# EasyEDA Pro project ProPrj_ax_driver_2025-11-09.epro, board axdr_v1.2
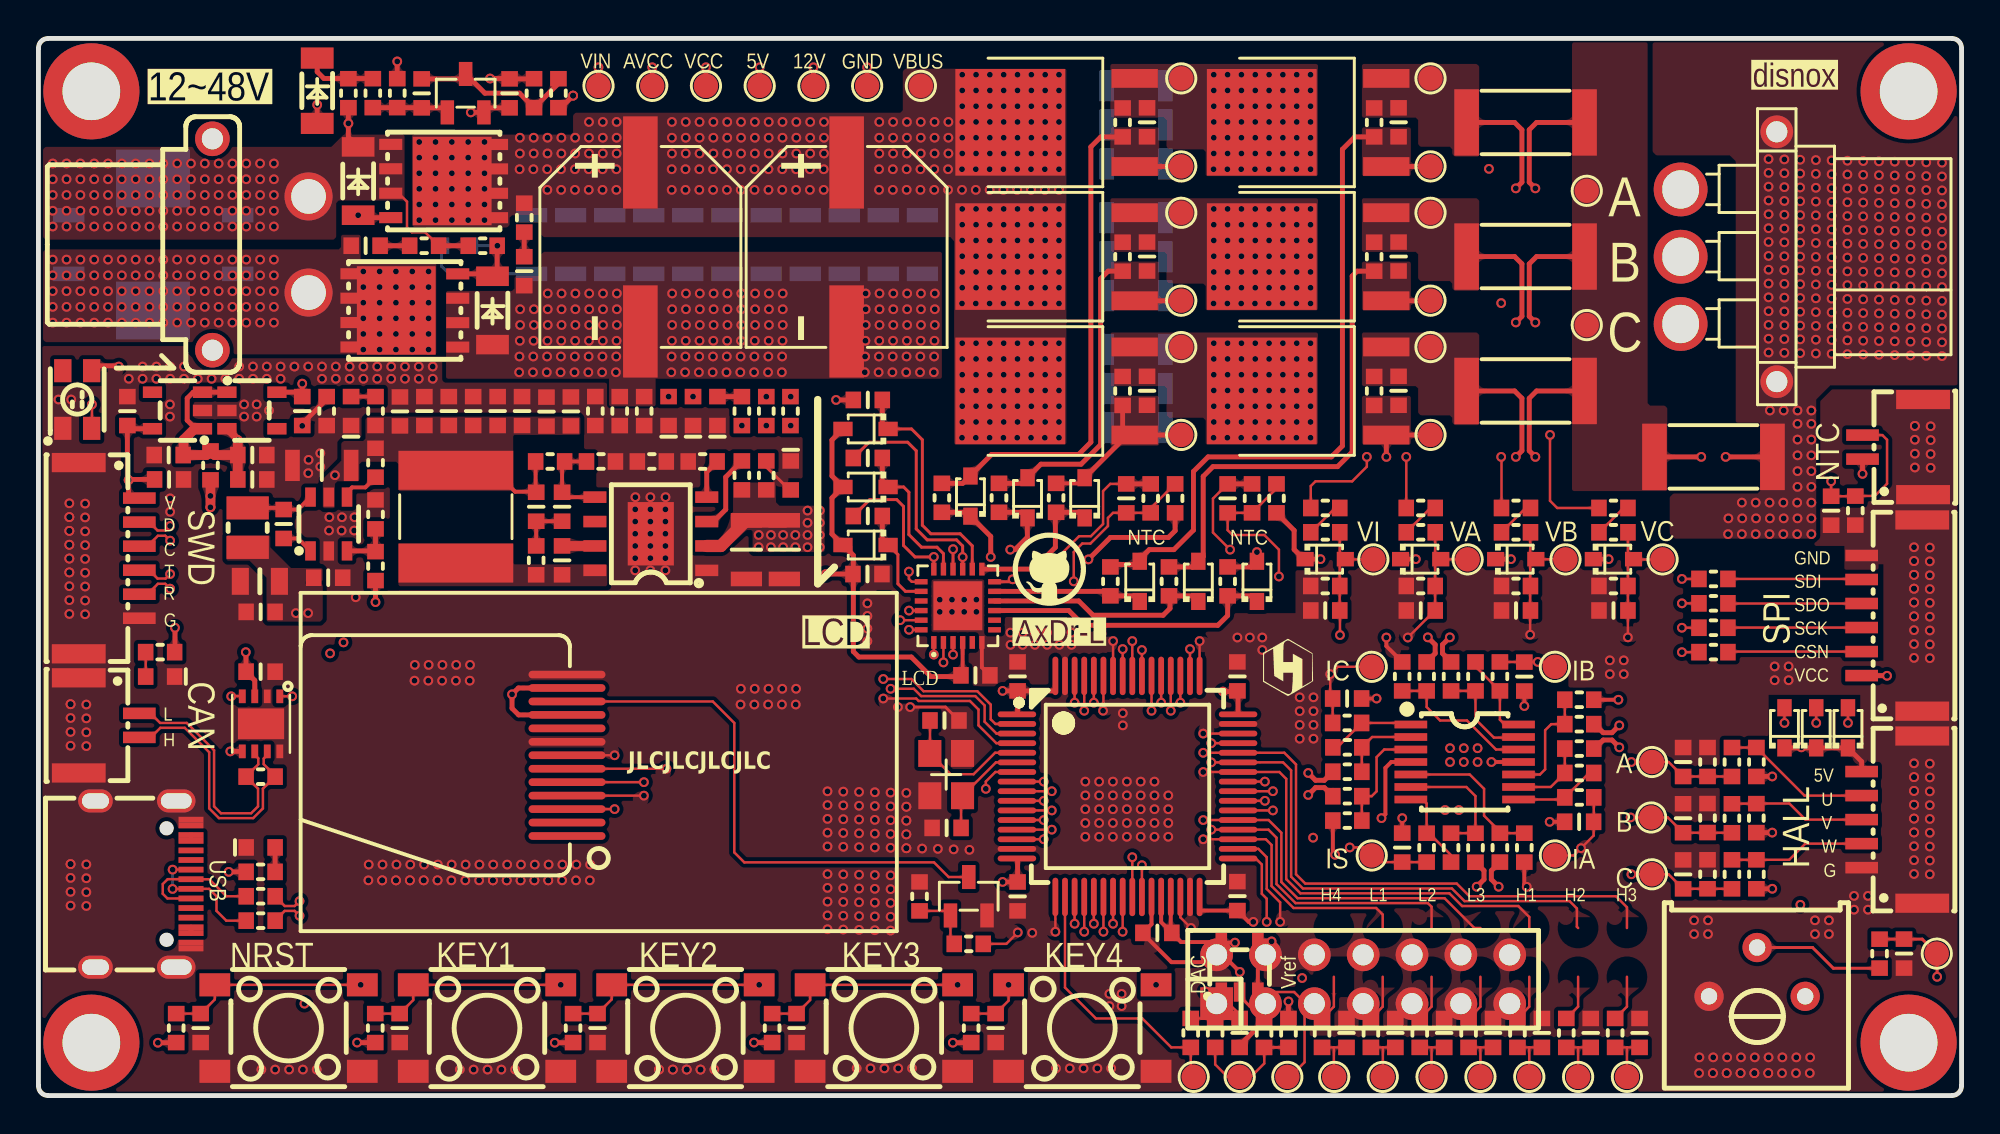
[diagram p10: board, top side]
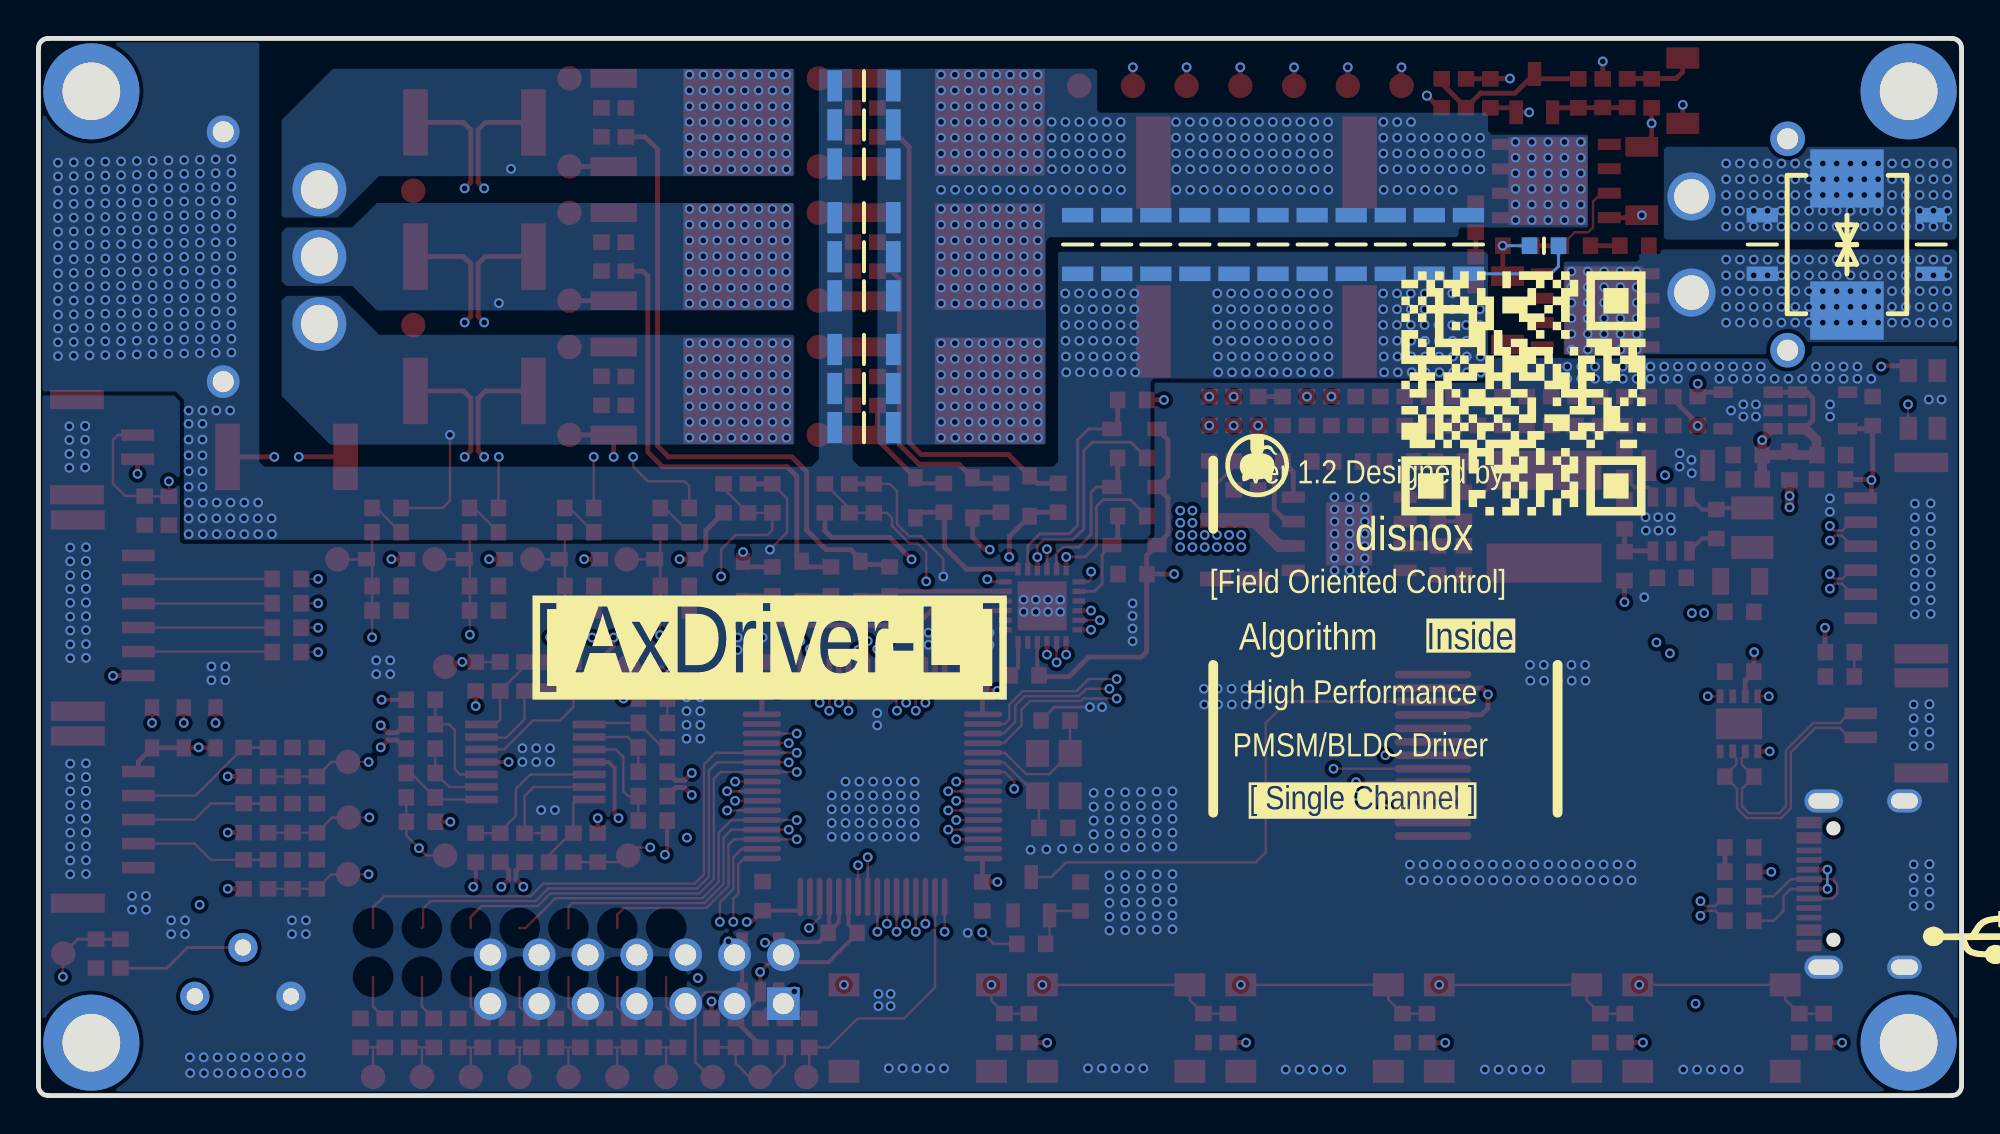
[diagram p11: board, bottom side, seen from below]

Outline 100 x 55 mm; copper layers: Top Layer, Inner1, Inner2, 内层3, 内层4, Bottom Layer. Coordinates in mm from the lower left corner of the outline.
Outline path: 0,54.5 arc(0.15,54.85) 0.5,55 99.5,55 arc(99.85,54.85) 100,54.5 100,0.5 arc(99.85,0.15) 99.5,0 0.5,0 arc(0.15,0.15) 0,0.5 0,54.5
Stack: Top Layer 0.035mm 外层铜厚1oz / Dielectric1 0.0994mm 3313 RC57% 4.2mil / Inner1 0.0152mm 内层铜厚 / Dielectric2 0.55mm 0.55mm H/H不含铜 / Inner2 0.0152mm 内层铜厚 / Dielectric3 0.1088mm 2116 RC54% 4.9mil / 内层3 0.0152mm 内层铜厚 / Dielectric4 0.55mm 0.55mm H/H不含铜 / 内层4 0.0152mm 内层铜厚 / Dielectric5 0.0994mm 3313 RC57% 4.2mil / Bottom Layer 0.035mm 外层铜厚1oz

## Design rules (mm)
template: 用户自定义配置
spacing safeClearance (default): track to track 0.127, other pairs 0.127 to 0.127
track width trackWidth (default): min 0.127, default 0.254, max 2.54
differential pair differentialPair (default): width min 0.127, default 0.254, max 2.54; gap min 0.127, default 0.127
via viaSize (default): diameter min 0.5, default 0.508, max 10; hole min 0.3, default 0.305, max 5.999

## Placement (name value [footprint] x y rotation side)
C1  100nF  [C0603_S]  24.5 52.15 90 top
C2  100nF  [C0603_S]  19.93 52.15 90 top
C3  220uF  [CAP-SMD_BD10.0-L10.3-W10.3-LS11.0-R-RD]  42.02 44.15 90 top
C4  220uF  [CAP-SMD_BD10.0-L10.3-W10.3-LS11.0-R-RD]  31.3 44.15 90 top
C5  10uF  [C1206_S]  37.83 44.41 270 bottom
C6  10uF  [C1206_S]  39.87 44.41 270 bottom
C7  10uF  [C1206_S]  45.96 44.41 270 bottom
C8  10uF  [C1206_S]  35.8 44.41 270 bottom
C9  10uF  [C1206_S]  33.77 44.41 270 bottom
C10  10uF  [C1206_S]  31.74 44.41 270 bottom
C11  10uF  [C1206_S]  43.93 44.41 270 bottom
C12  10uF  [C1206_S]  41.9 44.41 270 bottom
C13  10uF  [C1206_S]  27.67 44.41 270 bottom
C14  10uF  [C1206_S]  25.64 44.41 270 bottom
C15  10uF  [C1206_S]  29.71 44.41 270 bottom
C16  10uF  [C1206_S]  1.57 44.41 270 bottom
C17  10uF  [C1206_S]  10.36 44.41 270 bottom
C18  10nF  [C0603_S]  17.01 44.22 180 top
C19  100nF  [C0603_S]  21.7 44.22 180 bottom
C20  10nF  [C0603_S]  25.26 42.88 270 top
C21  2.2nF  [C0603_S]  27.23 27.84 270 top
C22  3.3nF  [C0603_S]  25.88 30.63 270 top
C23  10uF  [C1206_S]  38.79 28.53 270 top
C24  100nF  [C1206_S]  36.81 28.28 90 top
C25  2.2nF  [C0603_S]  27.23 30.63 270 top
C26  100nF  [C0603_S]  43.12 27.13 0 top
C27  10uF  [C0603_S]  26.42 35.58 270 top
C28  10uF  [C0603_S]  21.34 35.6 270 top
C29  10uF  [C1206_S]  14.86 32.78 180 top
C30  100nF  [C0603_S]  11.11 33.33 180 top
C31  100nF  [C0603_S]  62.34 21.8 270 top
C32  100nF  [C0603_S]  50.91 10.37 90 top
C33  100nF  [C0603_S]  6.78 32.05 180 top
C34  22pF  [C0603_S]  47.1 19.51 180 top
C35  22pF  [C0603_S]  47.23 13.93 0 top
C36  100nF  [C0603_S]  11.11 32.05 180 top
C37  10uF  [C0603_S]  18.8 35.6 90 top
C38  10uF  [C0603_S]  20.07 35.6 270 top
C39  10uF  [C0603_S]  27.69 35.6 90 top
C40  100nF  [C0603_S_3]  12.75 29.75 90 top
C41  100nF  [C0603_S]  6.78 33.33 0 top
C42  100nF  [C0603_S]  13.72 35.62 90 top
C43  100nF  [C0603_S]  58.19 8.46 0 top
C44  10uF  [C0805_S]  11.51 26.75 0 top
C45  100nF  [C0603_S]  11.56 25.16 0 top
C46  100nF  [C0603_S]  15.06 26.94 180 top
C47  100nF  [C0603_S]  11.54 22.05 180 top
C48  100nF  [C0603_S]  8.43 3.52 90 top
C49  100nF  [C0603_S]  18.78 3.52 90 top
C50  100nF  [C0603_S]  29.07 3.52 90 top
C51  100nF  [C0603_S]  39.42 3.52 90 top
C52  100nF  [C0603_S]  49.77 3.52 90 top
C53  1nF  [C0603_S]  97.01 7.39 90 top
C54  10nF  [C0603_S]  62.46 3.27 90 top
C55  100nF  [C0603_S]  50.91 21.8 270 top
C56  100nF  [C0603_S]  62.34 10.37 270 top
C57  100nF  [C0603_S]  4.62 35.6 270 top
C58  10uF  [C0603_S]  23.88 35.6 270 top
C59  10uF  [C0603_S]  25.15 35.6 270 top
C60  10uF  [C0603_S]  22.61 35.6 270 top
C61  1nF  [C0603_S]  70.91 12.89 270 top
C62  1nF  [C0603_S]  68.04 20.66 180 top
C63  1nF  [C0603_S]  57.65 50.63 270 top
C64  1nF  [C0603_S]  57.65 43.64 270 top
C65  1nF  [C0603_S]  57.65 36.66 270 top
C66  1uF  [C0603_S]  43.13 30.15 0 top
C67  1nF  [C0603_S]  80.12 14.24 0 top
C68  1nF  [C0603_S]  77.26 21.81 90 top
C69  100nF  [C0603_S]  48.71 21.86 180 top
C70  1uF  [C0603_S]  43.13 33.17 0 top
C71  1uF  [C0603_S]  43.13 36.19 0 top
C72  1nF  [C0603_S]  70.73 50.63 270 top
C73  1nF  [C0603_S]  70.73 43.64 270 top
C74  1nF  [C0603_S]  70.73 36.66 270 top
C75  1nF  [C0603_S]  71.89 25.24 0 top
C76  1nF  [C0603_S]  76.84 25.24 0 top
C77  1nF  [C0603_S]  81.91 25.24 0 top
C78  1nF  [C0603_S]  66.92 25.24 0 top
C79  1nF  [C0603_S]  61.84 31.06 270 top
C80  1nF  [C0603_S]  56.57 31.06 270 top
C81  1nF  [C0603_S]  93.22 30.44 90 top
C82  100nF  [C0603_S]  85.52 17.36 90 top
C83  100nF  [C0603_S]  85.52 14.44 90 top
C84  100nF  [C0603_S]  85.52 11.52 90 top
C85  100nF  [C0603_S]  78.18 3.27 90 top
C86  100nF  [C0603_S]  80.72 3.27 90 top
C87  100nF  [C0603_S]  83.26 3.27 90 top
C88  100nF  [C0603_S]  68.02 3.27 90 top
C91  100nF  [C0603_S]  70.56 3.27 90 top
C92  100nF  [C0603_S]  73.1 3.27 90 top
C93  100nF  [C0603_S]  75.64 3.27 90 top
C96  10uF  [C1206_S]  56.95 52.53 0 bottom
C97  10uF  [C1206_S]  56.95 45.68 0 bottom
C98  10uF  [C1206_S]  56.95 36.79 0 bottom
C99  10uF  [C1206_S]  56.95 50.5 0 bottom
C100  10uF  [C1206_S]  56.95 43.64 0 bottom
C101  10uF  [C1206_S]  56.95 48.47 0 bottom
C102  10uF  [C1206_S]  56.95 38.82 0 bottom
C103  10uF  [C1206_S]  56.95 41.61 0 bottom
C104  10uF  [C1206_S]  56.95 34.75 0 bottom
CN1  5012  [TESTPOINT-TH_BD2.0_C9900010656]  29.12 52.53 180 top
CN2  5012  [TESTPOINT-TH_BD2.0_C9900010656]  45.88 52.53 180 top
CN3  XT30PW-F  [CONN-TH_XT30PW-F]  11.54 44.28 270 top
CN4  5012  [TESTPOINT-TH_BD2.0_C9900010656]  40.3 52.53 0 top
CN5  5012  [TESTPOINT-TH_BD2.0_C9900010656]  34.71 52.53 180 top
CN6  5012  [TESTPOINT-TH_BD2.0_C9900010656]  43.09 52.53 0 top
CN7  5012  [TESTPOINT-TH_BD2.0_C9900010656]  37.5 52.53 0 top
CN8  5012  [TESTPOINT-TH_BD2.0_C9900010656]  31.91 52.53 270 top
CN9  WAFER-GH1.25-6PWB  [CONN-SMD_6P-P1.25_XUNPU_WAFER-GH1.25-6PWB]  3.67 27.96 270 top
CN10  5012  [TESTPOINT-TH_BD2.0_C9900010656]  98.71 7.38 0 top
CN11  X1251WRS-02HF-LPSW  [CONN-SMD_2P-P1.25_X1251WRS-02HF-LPSW]  3.54 19.26 270 top
CN12  5012  [TESTPOINT-TH_BD2.0_C9900010656]  60.07 0.97 0 top
CN13  5012  [TESTPOINT-TH_BD2.0_C9900010656]  64.94 0.97 0 top
CN14  5012  [TESTPOINT-TH_BD2.0_C9900010656]  69.33 12.49 0 top
CN15  5012  [TESTPOINT-TH_BD2.0_C9900010656]  69.33 22.31 0 top
CN16  5012  [TESTPOINT-TH_BD2.0_C9900010656]  62.46 0.97 0 top
CN17  5012  [TESTPOINT-TH_BD2.0_C9900010656]  59.42 48.34 0 top
CN18  5012  [TESTPOINT-TH_BD2.0_C9900010656]  59.42 41.36 0 top
CN19  5012  [TESTPOINT-TH_BD2.0_C9900010656]  59.42 34.37 0 top
CN20  5012  [TESTPOINT-TH_BD2.0_C9900010656]  78.85 12.49 180 top
CN21  5012  [TESTPOINT-TH_BD2.0_C9900010656]  78.85 22.31 0 top
CN22  5012  [TESTPOINT-TH_BD2.0_C9900010656]  59.42 52.92 0 top
CN23  5012  [TESTPOINT-TH_BD2.0_C9900010656]  59.42 45.93 0 top
CN24  5012  [TESTPOINT-TH_BD2.0_C9900010656]  59.42 38.94 0 top
CN25  5012  [TESTPOINT-TH_BD2.0_C9900010656]  72.39 48.34 0 top
CN26  5012  [TESTPOINT-TH_BD2.0_C9900010656]  72.39 41.36 0 top
CN27  5012  [TESTPOINT-TH_BD2.0_C9900010656]  72.39 34.37 0 top
CN28  5012  [TESTPOINT-TH_BD2.0_C9900010656]  72.39 52.92 0 top
CN29  5012  [TESTPOINT-TH_BD2.0_C9900010656]  72.39 45.93 0 top
CN30  5012  [TESTPOINT-TH_BD2.0_C9900010656]  72.39 38.94 0 top
CN31  5012  [TESTPOINT-TH_BD2.0_C9900010656]  83.9 17.35 270 top
CN32  5012  [TESTPOINT-TH_BD2.0_C9900010656]  83.86 14.47 270 top
CN33  5012  [TESTPOINT-TH_BD2.0_C9900010656]  83.9 11.51 270 top
CN34  X1251WRS-02HF-LPSW  [CONN-SMD_2P-P1.25_X1251WRS-02HF-LPSW]  96.55 33.74 90 top
CN35  5012  [TESTPOINT-TH_BD2.0_C9900010656]  80.51 40.09 0 top
CN36  5012  [TESTPOINT-TH_BD2.0_C9900010656]  80.51 47.07 0 top
CN37  5012  [TESTPOINT-TH_BD2.0_C9900010656]  74.32 27.9 90 top
CN38  5012  [TESTPOINT-TH_BD2.0_C9900010656]  79.4 27.9 90 top
CN39  5012  [TESTPOINT-TH_BD2.0_C9900010656]  84.45 27.9 90 top
CN40  5012  [TESTPOINT-TH_BD2.0_C9900010656]  69.41 27.9 90 top
CN41  MR30PW-F  [CONN-TH_MR30PW-F]  87.89 43.64 90 top
CN42  5012  [TESTPOINT-TH_BD2.0_C9900010656]  77.52 0.97 90 top
CN43  5012  [TESTPOINT-TH_BD2.0_C9900010656]  80.06 0.97 0 top
CN44  5012  [TESTPOINT-TH_BD2.0_C9900010656]  82.6 0.97 0 top
CN45  5012  [TESTPOINT-TH_BD2.0_C9900010656]  67.38 0.97 0 top
CN47  WAFER-GH1.25-6PWB  [CONN-SMD_6P-P1.25_XUNPU_WAFER-GH1.25-6PWB]  96.38 24.97 90 top
CN49  5012  [TESTPOINT-TH_BD2.0_C9900010656]  69.9 0.97 0 top
CN50  5012  [TESTPOINT-TH_BD2.0_C9900010656]  72.44 0.97 180 top
CN51  5012  [TESTPOINT-TH_BD2.0_C9900010656]  74.98 0.97 0 top
D1  ZMM12V  [LL-34_L3.5-W1.5-RD-2]  16.62 47.58 270 top
D2  1.5SMC30CAHE3/57T  [SMC_L6.8-W5.9-LS7.8-BI]  5.96 44.28 270 bottom
D3  ZMM12V  [LL-34_L3.5-W1.5-RD-2]  23.61 40.85 270 top
D4  TCLLZ39VTR  [LL-34_L3.5-W1.5-RD]  14.49 52.28 270 top
D5  B16WS  [SOD-323_L1.8-W1.3-LS2.5-RD#2]  48.46 31.19 90 top
D6  B16WS  [SOD-323_L1.8-W1.3-LS2.5-RD#2]  51.43 31.1 90 top
D7  B16WS  [SOD-323_L1.8-W1.3-LS2.5-RD#2]  54.4 31.1 90 top
D8  B16WS  [SOD-323_L1.8-W1.3-LS2.5-RD]  43.01 28.64 180 top
D9  B16WS  [SOD-323_L1.8-W1.3-LS2.5-RD]  43.01 31.66 180 top
D10  B16WS  [SOD-323_L1.8-W1.3-LS2.5-RD]  43.01 34.68 180 top
D11  B16WS  [SOD-323_L1.8-W1.3-LS2.5-RD#2]  57.26 26.75 90 top
D12  B16WS  [SOD-323_L1.8-W1.3-LS2.5-RD#2]  60.31 26.75 90 top
D13  B16WS  [SOD-323_L1.8-W1.3-LS2.5-RD#2]  63.36 26.75 90 top
D14  B16WS  [SOD-323_L1.8-W1.3-LS2.5-RD#2]  94.09 19.13 90 top
D15  B16WS  [SOD-323_L1.8-W1.3-LS2.5-RD#2]  71.87 27.91 0 top
D16  B16WS  [SOD-323_L1.8-W1.3-LS2.5-RD#2]  76.82 27.91 0 top
D17  B16WS  [SOD-323_L1.8-W1.3-LS2.5-RD#2]  81.9 27.91 0 top
D18  B16WS  [SOD-323_L1.8-W1.3-LS2.5-RD#2]  66.91 27.91 0 top
D19  B16WS  [SOD-323_L1.8-W1.3-LS2.5-RD#2]  90.79 19.13 90 top
D20  B16WS  [SOD-323_L1.8-W1.3-LS2.5-RD#2]  92.44 19.13 90 top
H1  2.54-2*7P针  [HDR-TH_14P-P2.54-V-F-R2-C6-S2.54]  67.36 6.18 0 top
IPSLCD1  TFT_1.14_135x240_13pin  [焊接式_TFT_1.14_135X240_13PIN]  13.63 17.35 180 top
K1  TS-KG02S  [SW-SMD_4P-L6.0-W6.0-P4.50-LS8.5]  13 3.51 0 top
K2  TS-KG02S  [SW-SMD_4P-L6.0-W6.0-P4.50-LS8.5]  23.32 3.51 0 top
K3  TS-KG02S  [SW-SMD_4P-L6.0-W6.0-P4.50-LS8.5]  33.64 3.51 0 top
K4  TS-KG02S  [SW-SMD_4P-L6.0-W6.0-P4.50-LS8.5]  43.96 3.51 0 top
K5  TS-KG02S  [SW-SMD_4P-L6.0-W6.0-P4.50-LS8.5]  54.28 3.51 0 top
L1  NCD0603R1  [LED0603_S]  39.12 32.89 90 top
L2  68uH  [IND-SMD_L6.0-W6.0_SMNR6045]  21.7 30.12 270 top
L3  NCD0603R1  [LED0603_S]  6.96 21.8 0 top
L4  NCD0603R1  [LED0603_S]  16.26 34.99 270 top
L5  NCD0603R1  [LED0603_S]  10.93 12.91 180 top
L6  NCD0603G1  [LED0603_S]  32.77 34.99 270 top
L7  4.7uH  [IND-SMD_L2.5-W2.0]  10.88 29.55 90 top
L8  NCD0603W1  [LED0603_S]  34.04 34.99 270 top
L9  NCD0603B1  [LED0603_S]  35.31 34.99 270 top
LED1  XL-3528RGBW-WS2812B  [LED-SMD_4P-L3.5-W2.8-BR-1]  2.02 36.21 270 top
NOREF  -  [Pad_e113]  2.75 52.25 0 top
NOREF#2  -  [Pad_e122]  97.25 2.75 0 top
NOREF#3  -  [Pad_e124]  97.25 52.25 0 top
NOREF#4  -  [Pad_e118]  2.75 2.75 0 top
NTC1  NCP18XH103F03RB  [R0603_S]  63.11 31.07 90 top
NTC2  NCP18XH103F03RB  [R0603_S]  57.84 31.07 90 top
Q1  WSD90P06DN56  [DFN-8_L5.8-W4.9-P1.27-LS6.0-BL-1]  21.07 47.58 270 top
Q2  FMMT593  [SOT-23-3_L2.9-W1.3-P1.90-LS2.4-BR]  22.21 52.15 270 top
Q3  WSD80120DN56  [DFN-8_L5.8-W4.9-P1.27-LS6.0-BL-1]  19.05 40.85 90 top
Q4  SS8050  [SOT-23-3_L2.9-W1.3-P1.90-LS2.4-BR]  48.37 10.37 270 top
Q5  NCE7560K  [TO-252-2_L6.6-W6.1-P4.58-LS9.9-BR]  53.96 50.63 0 top
Q6  NCE7560K  [TO-252-2_L6.6-W6.1-P4.58-LS9.9-BR]  53.96 43.64 0 top
Q7  NCE7560K  [TO-252-2_L6.6-W6.1-P4.58-LS9.9-BR]  53.96 36.66 0 top
Q8  NCE7560K  [TO-252-2_L6.6-W6.1-P4.58-LS9.9-BR]  67.04 50.63 0 top
Q9  NCE7560K  [TO-252-2_L6.6-W6.1-P4.58-LS9.9-BR]  67.04 43.64 0 top
Q10  NCE7560K  [TO-252-2_L6.6-W6.1-P4.58-LS9.9-BR]  67.04 36.66 0 top
R1  10kΩ  [R0603_S]  37.85 32.26 270 top
R2  1.5MΩ  [R0603_S]  18.66 52.15 90 top
R3  100kΩ  [R0603_S]  16.12 52.15 270 top
R4  22Ω  [R0603_S]  20.05 44.22 0 top
R5  100kΩ  [R0603_S]  23.1 44.22 180 top
R6  1kΩ  [R0603_S]  17.39 52.15 90 top
R7  22Ω  [R0603_S]  25.26 45.68 90 top
R8  1kΩ  [R0603_S]  25.77 52.15 270 top
R9  1kΩ  [R0603_S]  27.04 52.15 270 top
R10  0Ω  [R0603_S]  31.5 35.61 270 top
R11  0Ω  [R0603_S]  30.23 35.61 270 top
R12  0Ω  [R0603_S]  14.99 35.61 270 top
R13  453kΩ  [R0603_S]  25.88 27.84 90 top
R14  1kΩ  [R0603_S]  6.33 23.07 180 top
R15  100kΩ  [R0603_S]  36.58 32.26 90 top
R16  453kΩ  [R0603_S]  26.6 32.99 0 top
R17  22Ω  [R0603_S]  11.55 9.1 0 top
R18  22Ω  [R0603_S]  11.55 10.37 0 top
R19  100kΩ  [R0603_S]  34.54 32.99 180 top
R20  49.9kΩ  [R0603_S]  29.25 32.99 0 top
R21  1kΩ  [R0603_S]  48.37 7.89 0 top
R22  1kΩ  [R0603_S]  45.82 10.36 90 top
R23  0Ω  [R0603_S]  31.89 32.99 0 top
R24  0Ω  [R0603_S]  28.96 35.61 90 top
R25  10kΩ  [R0603_S]  17.53 35.61 270 top
R26  1kΩ  [R0603_S]  11.55 11.64 180 top
R27  0Ω  [R0603_S]  8.95 32.78 90 top
R28  1kΩ  [R0603_S]  39.1 35.61 270 top
R29  10kΩ  [R0603_S]  7.16 3.51 270 top
R30  10kΩ  [R0603_S]  17.51 3.51 270 top
R31  10kΩ  [R0603_S]  27.8 3.51 270 top
R32  10kΩ  [R0603_S]  38.15 3.51 270 top
R33  10kΩ  [R0603_S]  48.5 3.51 270 top
R34  1kΩ  [R0603_S]  37.85 35.61 90 top
R35  10kΩ  [RES-ADJ-TH_3P-L9.5-W9.5-P2.50-L_3386P]  89.37 6.43 180 top
R36  62kΩ  [R0603_S]  17.53 27.55 90 top
R37  10kΩ  [R0603_S]  95.74 7.38 270 top
R38  10kΩ  [R0603_S]  17.53 32.92 90 top
R39  12kΩ  [R0603_S]  17.53 30.23 90 top
R40  1kΩ  [R0603_S]  36.58 35.61 270 top
R41  20kΩ  [R0603_S]  73.45 12.9 90 top
R42  20kΩ  [R0603_S]  68.06 18.12 0 top
R44  1kΩ  [R0603_S]  74.72 12.89 90 top
R45  1kΩ  [R0603_S]  68.06 16.85 0 top
R46  10kΩ  [R0603_S]  65 3.26 90 top
R47  0Ω  [R0603_S]  59.92 3.26 90 top
R49  1kΩ  [R0603_S]  75.99 12.9 90 top
R50  22Ω  [R0603_S]  72.18 12.9 90 top
R51  20kΩ  [R0603_S]  77.26 12.9 90 top
R52  1kΩ  [R0603_S]  68.06 15.58 0 top
R53  22Ω  [R0603_S]  68.05 19.39 0 top
R54  0Ω  [R0603_S]  61.19 3.26 90 top
R55  20kΩ  [R0603_S]  68.06 14.31 0 top
R57  10kΩ  [R0603_S]  63.73 3.26 270 top
R59  22Ω  [R0603_S]  46.98 31.1 270 top
R60  22Ω  [R0603_S]  49.95 31.1 270 top
R61  22Ω  [R0603_S]  52.92 31.1 270 top
R62  10kΩ  [R0603_S]  56.38 50.63 90 top
R63  10kΩ  [R0603_S]  56.38 43.64 90 top
R64  10kΩ  [R0603_S]  56.38 36.66 90 top
R65  20kΩ  [R0603_S]  80.12 16.78 180 top
R66  20kΩ  [R0603_S]  74.72 21.81 270 top
R67  1kΩ  [R0603_S]  80.12 18.05 180 top
R68  1kΩ  [R0603_S]  73.45 21.81 270 top
R69  1kΩ  [R0603_S]  80.12 19.32 180 top
R70  22Ω  [R0603_S]  80.12 15.51 180 top
R71  20kΩ  [R0603_S]  80.12 20.59 180 top
R72  1kΩ  [R0603_S]  72.19 21.81 270 top
R73  22Ω  [R0603_S]  76 21.81 270 top
R74  20kΩ  [R0603_S]  70.91 21.81 270 top
R75  22Ω  [R0603_S]  55.74 26.75 270 top
R76  22Ω  [R0603_S]  58.79 26.75 270 top
R77  22Ω  [R0603_S]  61.84 26.75 270 top
R78  10kΩ  [R0603_S]  69.46 50.63 90 top
R79  10kΩ  [R0603_S]  69.46 43.64 90 top
R80  10kΩ  [R0603_S]  69.46 36.66 90 top
R81  5mΩ  [R2512_S]  77.33 50.63 0 top
R82  5mΩ  [R2512_S]  77.33 43.65 0 top
R83  5mΩ  [R2512_S]  77.33 36.66 0 top
R84  15kΩ  [R0603_S]  71.88 30.57 0 top
R85  15kΩ  [R0603_S]  76.83 30.57 0 top
R86  15kΩ  [R0603_S]  81.9 30.57 0 top
R87  15kΩ  [R0603_S]  66.91 30.57 0 top
R88  10kΩ  [R0603_S]  89.33 17.35 90 top
R89  10kΩ  [R0603_S]  89.33 14.43 90 top
R90  10kΩ  [R0603_S]  89.33 11.51 90 top
R91  15kΩ  [R0603_S]  71.88 29.31 0 top
R92  15kΩ  [R0603_S]  76.83 29.31 0 top
R93  15kΩ  [R0603_S]  81.9 29.31 0 top
R94  15kΩ  [R0603_S]  66.91 29.31 0 top
R95  10kΩ  [R0603_S]  88.06 17.35 270 top
R96  120Ω  [R0603_S]  11.55 16.59 180 top
R97  10kΩ  [R0603_S]  88.06 14.43 270 top
R98  10kΩ  [R0603_S]  88.06 11.51 270 top
R99  2kΩ  [R0603_S]  71.88 26.51 180 top
R100  2kΩ  [R0603_S]  76.83 26.51 180 top
R101  2kΩ  [R0603_S]  81.9 26.51 180 top
R102  2kΩ  [R0603_S]  66.91 26.51 180 top
R103  10kΩ  [R0603_S]  64.38 31.07 90 top
R104  10kΩ  [R0603_S]  59.11 31.07 90 top
R105  10kΩ  [R0603_S]  94.48 30.44 270 top
R106  10kΩ  [R0603_S]  86.79 17.35 90 top
R107  10kΩ  [R0603_S]  86.79 14.44 90 top
R108  10kΩ  [R0603_S]  86.79 11.51 90 top
R109  5mΩ  [R2512_S]  87.1 33.23 0 top
R111  10kΩ  [R0603_S]  76.91 3.26 90 top
R112  10kΩ  [R0603_S]  79.45 3.26 90 top
R113  10kΩ  [R0603_S]  81.99 3.26 90 top
R114  10kΩ  [R0603_S]  66.75 3.26 90 top
R117  22Ω  [R0603_S]  87.1 26.88 180 top
R118  22Ω  [R0603_S]  87.1 25.61 180 top
R120  22Ω  [R0603_S]  87.1 24.34 180 top
R121  22Ω  [R0603_S]  87.1 23.07 180 top
R122  10kΩ  [R0603_S]  69.29 3.26 90 top
R123  10kΩ  [R0603_S]  71.83 3.26 90 top
R124  10kΩ  [R0603_S]  74.37 3.26 90 top
U1  STM32G431RBT6  [LQFP-64_L10.0-W10.0-P0.50-LS12.0-BL]  56.63 16.08 270 top
U2  LM5164DDAR  [ESOP-8_L4.9-W3.9-P1.27-LS6.0-BL-EP]  31.84 29.23 90 top
U3  XC6210B332MR  [SOT-23-5_L3.0-W1.7-P0.95-LS2.8-BR]  7.23 35.64 0 top
U4  LP5907QMFX-3.3Q1  [SOT-23-5_L3.0-W1.7-P0.95-LS2.8-BR]  11.1 35.64 180 top
U5  RY8411  [SOT-23-6_L2.9-W1.6-P0.95-LS2.8-BR]  15.1 29.74 270 top
U6  LM321MF/NOPB  [SOT-23-5_L3.0-W1.7-P0.95-LS2.8-BR]  62.46 6.69 270 top
U7  FD6288Q  [QFN-24_L4.0-W4.0-P0.50-BL-EP2.6]  47.81 25.48 0 top
U8  WAFER-GH1.25-5PWB  [conn-smd_5p-p1.25_xunpu_wafer-gh1.25-5pwb]  96.38 14.36 90 top
U9  TJA1051TK/3/1J  [HVSON-8_L3.0-W3.0-P0.65-BL-EP]  11.57 19.34 180 top
U10  RS624XQ  [TSSOP-14_L5.0-W4.4-P0.65-LS6.4-BL]  74.16 17.35 270 top
USBC1  -  [USB-C_SMD-TYPE-C-31-M-12]  5.45 11 270 top
X1  8MHz  [CRYSTAL-SMD_4P-L3.2-W2.5-BL]  47.2 16.7 270 top

## Footprints (pads in the part's own frame, mm; a bottom-side part is the same pattern mirrored in y, then rotated)
C0603_S
  rect 0.806x0.864 smd: 1(-0.762,0) 2(0.745,0)
C0603_S_3
  rect 0.806x0.864 smd: 1(-0.762,0) 2(0.745,0)
C0805_S
  rect 0.889x1.399 smd: 1(1.016,0) 2(-1.016,0)
C1206_S
  rect 0.762x1.625 smd: 1(1.651,0) 2(-1.397,0)
CAP-SMD_BD10.0-L10.3-W10.3-LS11.0-R-RD
  rect 4.8x1.8 smd: 1(4.395,0) 2(-4.395,0)
CONN-SMD_2P-P1.25_X1251WRS-02HF-LPSW
  rect 0.6x1.7 smd: 1(-0.625,1.702) 2(0.625,1.702)
  rect 1x2.799 smd: 3(2.475,-1.448) 4(-2.475,-1.448)
conn-smd_5p-p1.25_xunpu_wafer-gh1.25-5pwb
  rect 0.6x1.7 smd: 1(-2.5,1.575) 2(-1.25,1.575) 3(-0.001,1.575) 4(1.25,1.575) 5(2.5,1.575)
  rect 1x2.8 smd: 6(4.35,-1.575) 7(-4.35,-1.575)
CONN-SMD_6P-P1.25_XUNPU_WAFER-GH1.25-6PWB
  rect 0.6x1.7 smd: 1(-3.125,1.575) 2(-1.875,1.575) 3(-0.625,1.575) 4(0.625,1.575) 5(1.875,1.575) 6(3.125,1.575)
  rect 1x2.8 smd: 7(4.975,-1.575) 8(-4.975,-1.575)
CONN-TH_MR30PW-F
  round 2.8 hole 1.995x1.9: 1(-3.5,2.5) 2(0,2.5) 3(3.5,2.5)
  round 1.7 hole 1.1: 4(6.5,-2.5) 5(-6.5,-2.5)
CONN-TH_XT30PW-F
  round 2.5 hole 1.8: 1(-2.5,2.5) 2(2.5,2.5)
  round 1.8 hole 1.1: 3(5.5,-2.5) 4(-5.5,-2.5)
CRYSTAL-SMD_4P-L3.2-W2.5-BL
  rect 1.4x1.2 smd: 1(-1.1,-0.85) 2(1.1,-0.85) 3(1.1,0.85) 4(-1.1,0.85)
DFN-8_L5.8-W4.9-P1.27-LS6.0-BL-1
  rect 0.579x1.199 smd: 1(1.903,-2.751) 2(-1.903,2.751) 2(-0.632,2.751) 2(0.637,2.751) 2(1.907,2.751) 3(-1.907,-2.751) 3(-0.637,-2.751) 3(0.632,-2.751)
  rect 4.6x4.099 smd: 2(-0.003,0.445)
ESOP-8_L4.9-W3.9-P1.27-LS6.0-BL-EP
  rect 0.6x1.2 smd: 1(-1.905,-2.909) 2(-0.635,-2.909) 3(0.635,-2.909) 4(1.905,-2.909) 5(1.905,2.909) 6(0.635,2.909) 7(-0.635,2.909) 8(-1.905,2.909)
  rect 3.3x2.4 smd: 9(0,0)
HDR-TH_14P-P2.54-V-F-R2-C6-S2.54
  rect 1.7x1.7 hole 1.1: 1(-6.096,-1.397)
  round 1.7 hole 1.1: 2(-6.096,1.143) 3(-3.556,-1.397) 4(-3.556,1.143) 5(-1.016,-1.397) 6(-1.016,1.143) 7(1.524,-1.397) 8(1.524,1.143) 9(4.064,-1.397) 10(4.064,1.143) 11(6.604,-1.397) 12(6.604,1.143) 13(9.144,-1.397) 14(9.144,1.143)
HVSON-8_L3.0-W3.0-P0.65-BL-EP
  rect 0.355x0.711 smd: 1(-0.976,-1.433) 2(-0.325,-1.433) 3(0.325,-1.433) 4(0.976,-1.433) 5(0.976,1.433) 6(0.325,1.433) 7(-0.325,1.433) 8(-0.976,1.433)
  rect 2.401x1.6 smd: 9(0,0)
IND-SMD_L2.5-W2.0
  rect 1.2x2.2 smd: 1(1.028,0) 2(-1.028,0)
IND-SMD_L6.0-W6.0_SMNR6045
  rect 2.032x5.969 smd: 1(2.413,0) 2(-2.413,0)
LED0603_S
  rect 0.806x0.864 smd: 1(-1.381,-0.001) 2(0.126,-0.001)
LED-SMD_4P-L3.5-W2.8-BR-1
  rect 1.2x0.9 smd: 1(1.5,-0.75) 2(1.5,0.75) 3(-1.5,0.75) 4(-1.5,-0.75)
LL-34_L3.5-W1.5-RD
  rect 1.1x1.7 smd: 1(-1.7,0) 2(1.7,0)
LL-34_L3.5-W1.5-RD-2
  rect 1.016x1.7 smd: 1(-1.778,0) 2(1.778,0)
LQFP-64_L10.0-W10.0-P0.50-LS12.0-BL
  oval 0.3x2 smd: 1(-3.75,-5.75) 2(-3.25,-5.75) 3(-2.75,-5.75) 4(-2.25,-5.75) 5(-1.75,-5.75) 6(-1.25,-5.75) 7(-0.75,-5.75) 8(-0.25,-5.75) 9(0.25,-5.75) 10(0.75,-5.75) 11(1.25,-5.75) 12(1.75,-5.75) 13(2.25,-5.75) 14(2.75,-5.75) 15(3.25,-5.75) 16(3.75,-5.75) 33(3.75,5.75) 34(3.25,5.75) 35(2.75,5.75) 36(2.25,5.75) 37(1.75,5.75) 38(1.25,5.75) 39(0.75,5.75) 40(0.25,5.75) 41(-0.25,5.75) 42(-0.75,5.75) 43(-1.25,5.75) 44(-1.75,5.75) 45(-2.25,5.75) 46(-2.75,5.75) 47(-3.25,5.75) 48(-3.75,5.75)
  oval 2x0.3 smd: 17(5.75,-3.75) 18(5.75,-3.25) 19(5.75,-2.75) 20(5.75,-2.25) 21(5.75,-1.75) 22(5.75,-1.25) 23(5.75,-0.75) 24(5.75,-0.25) 25(5.75,0.25) 26(5.75,0.75) 27(5.75,1.25) 28(5.75,1.75) 29(5.75,2.25) 30(5.75,2.75) 31(5.75,3.25) 32(5.75,3.75) 49(-5.75,3.75) 50(-5.75,3.25) 51(-5.75,2.75) 52(-5.75,2.25) 53(-5.75,1.75) 54(-5.75,1.25) 55(-5.75,0.75) 56(-5.75,0.25) 57(-5.75,-0.25) 58(-5.75,-0.75) 59(-5.75,-1.25) 60(-5.75,-1.75) 61(-5.75,-2.25) 62(-5.75,-2.75) 63(-5.75,-3.25) 64(-5.75,-3.75)
Pad_e113
  round 5 hole 3: 1(0,0)
Pad_e118
  round 5 hole 3: 1(0,0)
Pad_e122
  round 5 hole 3: 1(0,0)
Pad_e124
  round 5 hole 3: 1(0,0)
QFN-24_L4.0-W4.0-P0.50-BL-EP2.6
  rect 0.28x0.665 smd: 1(-1.25,-1.907) 2(-0.75,-1.907) 3(-0.25,-1.907) 4(0.25,-1.907) 5(0.75,-1.907) 6(1.25,-1.907) 13(1.25,1.907) 14(0.75,1.907) 15(0.25,1.907) 16(-0.25,1.907) 17(-0.75,1.907) 18(-1.25,1.907)
  rect 0.665x0.28 smd: 7(1.907,-1.25) 8(1.907,-0.75) 9(1.907,-0.25) 10(1.907,0.25) 11(1.907,0.75) 12(1.907,1.25) 19(-1.907,1.25) 20(-1.907,0.75) 21(-1.907,0.25) 22(-1.907,-0.25) 23(-1.907,-0.75) 24(-1.907,-1.25)
  rect 2.55x2.55 smd: 25(0,0)
R0603_S
  rect 0.806x0.864 smd: 1(-0.752,0) 2(0.754,0)
R2512_S
  rect 1.282x3.456 smd: 1(-3.067,0) 2(3.067,0)
RES-ADJ-TH_3P-L9.5-W9.5-P2.50-L_3386P
  round 1.524 hole 0.85: 1(-2.5,1.27) 2(0,-1.27) 3(2.5,1.27)
SMC_L6.8-W5.9-LS7.8-BI
  rect 3.03x3.82 smd: 1(3.434,0) 2(-3.434,0)
SOD-323_L1.8-W1.3-LS2.5-RD
  rect 1x0.75 smd: 1(-1.173,0) 2(1.173,0)
SOD-323_L1.8-W1.3-LS2.5-RD#2
  rect 0.889x0.75 smd: 1(-1.046,0) 2(1.046,0)
SOT-23-3_L2.9-W1.3-P1.90-LS2.4-BR
  rect 1.25x0.7 smd: 1(1,-0.95) 2(1,0.95) 3(-1,0)
SOT-23-5_L3.0-W1.7-P0.95-LS2.8-BR
  rect 1x0.6 smd: 1(1.3,-0.95) 2(1.3,0) 3(1.3,0.95) 4(-1.3,0.95) 5(-1.3,-0.95)
SOT-23-6_L2.9-W1.6-P0.95-LS2.8-BR
  rect 1x0.55 smd: 1(1.4,-0.95) 2(1.4,0) 3(1.4,0.95) 4(-1.4,0.95) 5(-1.4,0) 6(-1.4,-0.95)
SW-SMD_4P-L6.0-W6.0-P4.50-LS8.5
  rect 1.6x1.2 smd: 1(-3.835,-2.25) 1(3.835,-2.25) 2(-3.835,2.25) 2(3.835,2.25)
TESTPOINT-TH_BD2.0_C9900010656
  round 1.27 smd: 1(0,0)
TO-252-2_L6.6-W6.1-P4.58-LS9.9-BR
  rect 2.408x0.978 smd: 1(3.043,-2.291) 3(3.043,2.291)
  rect 5.71x5.548 smd: 2(-3.429,0.006)
TSSOP-14_L5.0-W4.4-P0.65-LS6.4-BL
  rect 0.4x1.7 smd: 1(-1.95,-2.8) 2(-1.3,-2.8) 3(-0.65,-2.8) 4(0,-2.8) 5(0.65,-2.8) 6(1.3,-2.8) 7(1.95,-2.8) 8(1.95,2.8) 9(1.3,2.8) 10(0.65,2.8) 11(0,2.8) 12(-0.65,2.8) 13(-1.3,2.8) 14(-1.95,2.8)
USB-C_SMD-TYPE-C-31-M-12
  oval 1.2x2 hole 0.8x1.6: 0(-4.325,1.716) 0(4.325,1.716)
  oval 1.2x1.8 hole 0.8x1.4: 0(-4.325,-2.484) 0(4.325,-2.484)
  rect 0.3x1.3 smd: A1(-3.35,2.484) A4(-2.55,2.484) A5(-1.25,2.484) A6(-0.25,2.484) A7(0.25,2.484) A8(1.25,2.484) A9(2.55,2.484) A12(3.35,2.484) B1(3.05,2.484) B4(2.25,2.484) B5(1.75,2.484) B6(0.75,2.484) B7(-0.75,2.484) B8(-1.75,2.484) B9(-2.25,2.484) B12(-3.05,2.484)
焊接式_TFT_1.14_135X240_13PIN
  oval 4x0.399 smd: 1(-13.851,3.85) 2(-13.851,3.15) 3(-13.851,2.451) 4(-13.851,1.75) 5(-13.851,1.049) 6(-13.851,0.35) 7(-13.851,-0.35) 8(-13.851,-1.049) 9(-13.851,-1.75) 10(-13.851,-2.451) 11(-13.851,-3.15) 12(-13.851,-3.85) 13(-13.851,-4.549)

## Nets
As in the schematic.

Pads without a net: CN3 3 4; IPSLCD1 1 2 9; LED1 4; NOREF 1; NOREF#2 1; NOREF#3 1; NOREF#4 1; U2 6; U3 4; U4 4; U7 5 7 8 21; USBC1 A4 A5 A8 A9 B4 B5 B8 B9

## Via types
v1: diameter 0.508, hole 0.305, Top Layer to Bottom Layer, 1742 vias

## Routing (per net, layer and track width the routed paths; a pad name or vN(x,y) marks a point on that pad's centre or on a via; arc(x,y) is an arc through that point)
5V: length 210.8
  Top Layer w0.254: R90.1 v1(90.16,10.76) ; v1(9.89,11.64) R26.2 ; R89.1 v1(90.16,13.68) ; R88.1 v1(90.16,16.6) ; LED1.3 3.02,37.97 4.15,37.97 ; v1(10.78,23.07) 10.79,23.06 10.79,22.05 11.25,21.6 U9.3 ; 8.17,34.69 7.73,35.13 7.73,36.28 8.05,36.59 U3.3 U4.1 ; CN7.1 v1(37.5,53.5) ; D19.1 D20.1 D14.1 94.81,17.38 U8.5
  Top Layer w0.381: U4.3 10.37,34.13 v1(10.37,34.1)
  Top Layer w0.508: C30.2 9.16,33.33 R27.2 8.73,33.33 C41.2 7.54,33.34 7.54,34.12 8.12,34.69 U3.1 ; C30.2 v1(10.37,34.1) ; C30.2 C36.2
  Inner2 w0.152: v1(37.5,53.5) 37.5,52.71 36.94,52.15 32.82,52.15 31.42,50.76 31.42,36.4 30.47,35.45 15.99,35.45 14.64,34.1 v1(10.37,34.1)
  Inner2 w0.254: v1(91.67,18.12) v1(90.16,16.6) 90.16,13.68 v1(90.16,13.68) 90.16,13.68 v1(90.16,10.76)
  内层3 w0.254: v1(90.16,10.76) 90.15,10.75 86.09,10.75 84.57,9.23 84.57,5.16 83.43,4.02 12.81,4.02 11.54,5.29 11.54,9.99 v1(9.89,11.64) 9,12.53 5.96,12.53 4.56,13.93 4.56,21.25 6.38,23.07 v1(10.78,23.07) 10.78,24.72 7.54,27.96 7.54,34.1 ; 7.54,34.1 5.34,34.1 4.18,35.26 4.18,37.99 ; 7.54,34.1 v1(10.37,34.1)
  vias: v1(4.18,37.93)
12V: length 88.8
  Top Layer w0.203: R16.1 25.85,31.42 ; 25.85,31.42 C22.1 ; 25.85,31.42 24.79,31.42 23.64,32.57 21.7,32.57 ; 47.97,21.86 48.06,21.95 U7.4
  Top Layer w0.254: 42.37,27.13 42.37,28.11 41.26,29.22 41.26,31.09 41.84,31.66 41.26,32.24 41.26,34.11 41.84,34.68 ; 42.37,27.13 42.37,23.1 42.66,22.82 45.39,22.82 46.41,21.8 47.91,21.8 47.97,21.86 ; 42.37,27.13 v1(40.94,27.13) ; CN4.1 v1(40.3,53.5)
  Inner2 w0.152: 31.8,34.94 31.8,50.56 33.07,51.83 39.74,51.83 40.3,52.39 v1(40.3,53.5)
  Inner2 w0.254: v1(40.94,27.13) 35.8,27.13 34.79,28.15 34.79,33.67 33.52,34.94 17.39,34.94 15.42,32.98 v1(15.42,32.28)
AGND: length 111.8
  Top Layer w0.152: R57.1 63.73,4.03 63.11,4.65 62.98,4.65 62.46,5.18 U6.2
  Top Layer w0.203: U6.2 62.46,6.42 v1(62.47,6.43) 61.96,6.94 58.92,6.94 57.43,8.43 C43.1 57.88,8.91 U1.27 ; C62.1 v1(69.58,20.66) ; 76.96,17.35 v1(75.55,17.35) ; C67.1 v1(78.58,14.24) ; C68.1 v1(77.26,20.27) ; C61.1 70.91,14.43 v1(70.92,14.43)
  Top Layer w0.254: C54.1 62.46,2.61 63.73,3.88 R57.1 ; v1(13.72,34.84) 13.72,34.96 14.99,36.23 R12.1
  Inner2 w0.203: v1(15.16,23.01) 15.16,9.92 21.39,3.7 61.14,3.7 62.47,5.04 v1(62.47,6.43)
  内层3 w0.203: v1(70.92,14.43) 70.92,13.29 68.95,11.32 67.3,11.32 66.03,10.05 66.03,7.45 65.01,6.43 v1(62.47,6.43)
  内层3 w0.254: v1(15.16,23.01) 15.16,25.29 12.62,27.83 12.62,33.75 v1(13.72,34.84)
AVCC: length 147.3
  Top Layer w0.203: 58.88,8.52 58.38,9.02 U1.28 ; 58.88,8.52 U1.29 ; 58.88,8.52 C43.2 59.41,7.99 U6.5 61.54,7.96 v1(62.22,7.96) ; v1(69.84,14.43) 70.04,14.64 70.04,17.05 70.35,17.35 U10.4
  Top Layer w0.254: v1(65,4.9) R46.2 ; U4.5 13.47,36.59 13.72,36.35 v1(13.72,37.04) ; CN8.1 v1(31.91,53.5)
  Inner2 w0.152: v1(31.91,53.5) 31.91,52.65 30.66,51.39 30.66,37.1 29.96,36.4 14.35,36.4 v1(13.72,37.04)
  Inner2 w0.203: v1(60.69,5.42) 59.45,4.17 22,4.17 15.86,10.31 v1(15.86,23.58)
  内层3 w0.203: 62.22,7.32 64.95,7.32 65.58,7.96 65.58,10.31 67.04,11.77 68.57,11.77 69.84,13.04 v1(69.84,14.43) ; 62.22,7.32 v1(62.22,7.96) ; 62.22,7.32 61.39,7.32 60.69,6.62 v1(60.69,5.42) 61.2,4.91 65.01,4.91
  内层3 w0.254: v1(15.86,23.58) 15.86,25.48 13.32,28.02 13.32,33.42 14.4,34.5 14.4,36.35 v1(13.72,37.04)
GND: length 63.4
  Top Layer w0.127: C79.1 61.07,31.06 61.07,29.29 v1(61.96,28.4) ; C80.1 55.73,31.82 55.36,31.45 55.36,29.74 54.72,29.1 54.11,29.1 52.95,27.94 v1(52.95,27.01)
  Top Layer w0.152: C34.1 47.17,20.21 v1(45.33,20.21)
  Top Layer w0.203: C69.1 49.06,22.28 U7.6
  Top Layer w0.254: C80.1 NTC2.2 ; C79.1 NTC1.2 ; CN6.1 v1(43.09,53.5)
  Inner1 w0.254: v1(43.09,53.5) 42.34,54.25 20.88,54.25 18.47,51.83 18.47,44.79 19.04,44.22 21.45,44.22 22.1,43.56 22.1,36.81
  vias: v1(1.04,36.21) v1(1.61,30.81) v1(1.61,30.1) v1(1.61,30.1) v1(1.61,29.38) v1(1.61,29.38) v1(1.61,28.66) v1(1.61,28.65) v1(1.61,27.94) v1(1.61,27.94) v1(1.61,27.22) v1(1.61,27.22) v1(1.61,26.5) v1(1.61,25.78) v1(1.61,25.06) v1(1.7,36.21) v1(1.67,20.36) v1(1.67,20.36) v1(1.67,19.64) v1(1.67,18.92) v1(1.67,18.2) v1(1.67,12.04) v1(1.67,12.04) v1(1.67,11.32) v1(1.67,10.6) v1(1.67,9.88) v1(2.43,30.8) v1(2.43,30.08) v1(2.43,29.35) v1(2.43,28.64) v1(2.43,27.92) v1(2.43,27.2) v1(2.43,26.48) v1(2.43,25.76) v1(2.43,25.04) v1(2.49,20.34) v1(2.49,19.63) v1(2.49,18.9) v1(2.49,18.18) v1(2.49,12.02) v1(2.49,11.31) v1(2.49,10.58) v1(2.49,9.86) v1(4.7,37.29) v1(5.41,37.93) v1(5.41,37.29) v1(6.13,37.93) v1(6.13,37.29) v1(6.85,37.93) v1(6.85,37.29) v1(6.84,35.96) v1(6.84,35.33) v1(6.85,31.07) v1(6.85,30.37) v1(7.57,37.93) v1(7.57,37.29) v1(8.28,37.29) v1(9,37.29) v1(9.72,37.29) v1(10.44,37.93) v1(10.44,37.29) v1(10.69,35.96) v1(10.69,35.33) v1(11.16,37.93) v1(11.16,37.29) v1(11.35,35.96) v1(11.35,35.33) v1(11.59,1.35) v1(11.87,37.93) v1(11.87,37.29) v1(11.99,35.64) v1(12.31,1.35) v1(12.59,37.93) v1(12.59,37.29) v1(13.03,1.35) v1(13.31,37.93) v1(13.75,1.35) v1(14.03,37.93) v1(14.05,33.07) v1(14.03,32.38) v1(14.47,1.35) v1(14.66,33.42) v1(14.66,32.72) v1(14.74,37.93) v1(14.74,37.29) v1(15.13,30.09) v1(15.11,29.4) v1(15.46,37.93) v1(15.46,37.29) v1(15.78,30.09) v1(15.76,29.4) v1(16.18,37.93) v1(16.18,37.29) v1(16.42,29.4) v1(16.43,30.09) v1(16.5,25.93) v1(16.9,37.93) v1(16.9,37.29) v1(17.17,12.02) v1(17.16,11.2) v1(17.62,37.93) v1(17.62,37.29) v1(17.89,12.02) v1(17.87,11.2) v1(17.87,11.2) v1(18.34,37.93) v1(18.34,37.29) v1(18.62,12.02) v1(18.59,11.2) v1(18.59,11.2) v1(19.06,37.93) v1(19.06,37.29) v1(19.32,11.2) v1(19.31,11.2) v1(19.33,12.02) v1(19.57,22.41) v1(19.55,21.59) v1(19.78,37.93) v1(19.78,37.29) v1(20.05,12.02) v1(20.03,11.2) v1(20.03,11.2) v1(20.29,22.41) v1(20.27,21.59) v1(20.5,37.93) v1(20.5,37.29) v1(20.77,12.02) v1(20.75,11.2) v1(20.75,11.2) v1(21.01,22.41) v1(20.99,21.59) v1(21.49,12.02) v1(21.47,11.2) v1(21.72,22.41) v1(21.71,21.59) v1(21.91,1.35) v1(22.21,12.02) v1(22.2,11.2) v1(22.42,21.59) v1(22.44,22.41) v1(22.63,1.35) v1(22.91,11.2) v1(22.93,12.02) v1(23.35,1.35) v1(23.65,12.02) v1(23.63,11.2) v1(23.63,11.2) v1(24.07,1.35) v1(24.37,12.02) v1(24.35,11.2) v1(24.35,11.2) v1(24.79,1.35) v1(25.09,12.02) v1(25.07,11.2) v1(25.07,11.2) v1(25.81,12.02) v1(25.79,11.2) v1(25.78,11.2) v1(26.51,11.2) v1(26.51,11.2) v1(26.53,12.02) v1(27.24,12.02) v1(27.23,11.2) v1(27.97,12.02) v1(27.95,11.2) v1(28.69,12.02) v1(28.67,11.2) v1(31.04,31.13) v1(31.03,30.5) v1(31.03,29.86) v1(31.03,29.23) v1(31.03,28.59) v1(31.03,27.96) v1(31.03,27.32) v1(31.82,31.13) v1(31.82,30.5) v1(31.82,29.86) v1(31.82,29.23) v1(31.82,28.59) v1(31.82,27.96) v1(31.82,27.32) v1(32.27,1.35) v1(32.26,1.35) v1(32.61,31.13) v1(32.6,30.5) v1(32.6,29.86) v1(32.6,29.23) v1(32.6,28.59) v1(32.6,27.96) v1(32.6,27.32) v1(32.98,1.35) v1(32.99,1.35) v1(33.71,1.35) v1(33.71,1.35) v1(34.43,1.35) v1(34.43,1.35) v1(35.14,1.35) v1(36.53,21.16) v1(36.51,20.34) v1(37.23,20.34) v1(37.24,21.16) v1(37.96,21.16) v1(37.94,20.34) v1(38.68,21.16) v1(38.66,20.34) v1(39.4,21.16) v1(39.38,20.34) v1(41.03,15.83) v1(41.03,15.11) v1(41.03,14.39) v1(41.03,13.68) v1(41.03,12.96) v1(41.03,11.52) v1(41.03,10.81) v1(41.03,10.09) v1(41.03,9.37) v1(41.03,8.65) v1(41.85,15.81) v1(41.85,15.1) v1(41.85,14.38) v1(41.85,13.66) v1(41.85,12.94) v1(41.85,11.51) v1(41.85,10.79) v1(41.85,10.07) v1(41.85,9.35) v1(41.85,8.64) v1(42.55,1.42) v1(42.67,15.8) v1(42.67,15.08) v1(42.67,14.36) v1(42.67,13.64) v1(42.67,12.93) v1(42.67,11.49) v1(42.67,10.77) v1(42.67,10.05) v1(42.67,9.34) v1(42.67,8.62) v1(43.1,25.61) v1(43.1,24.95) v1(43.1,24.3) v1(43.1,23.64) v1(43.26,1.42) v1(43.49,15.78) v1(43.49,15.06) v1(43.49,14.34) v1(43.49,13.63) v1(43.49,12.91) v1(43.49,11.47) v1(43.49,10.76) v1(43.49,10.04) v1(43.49,9.32) v1(43.49,8.6) v1(43.99,1.42) v1(44.31,15.76) v1(44.31,15.05) v1(44.31,14.33) v1(44.31,13.61) v1(44.31,12.89) v1(44.31,11.46) v1(44.31,10.74) v1(44.31,10.02) v1(44.31,9.3) v1(44.31,8.59) v1(44.69,20.21) v1(44.71,1.42) v1(45.13,15.75) v1(45.13,15.03) v1(45.13,15.03) v1(45.13,14.31) v1(45.13,14.3) v1(45.13,13.59) v1(45.13,13.59) v1(45.13,12.87) v1(45.13,12.87) v1(45.43,1.42) v1(45.95,12.85) v1(46.77,12.83) v1(46.87,25.8) v1(46.87,25.16) v1(47.5,25.8) v1(47.5,25.16) v1(47.59,12.81) v1(48.14,25.8) v1(48.14,25.16) v1(48.41,12.78) v1(48.77,25.8) v1(48.77,25.16) v1(50.54,24.09) v1(50.54,23.45) v1(51.18,24.09) v1(51.18,23.45) v1(51.68,8.46) v1(51.81,24.09) v1(51.81,23.45) v1(52.45,24.09) v1(52.45,23.45) v1(52.91,1.42) v1(53.08,24.09) v1(53.08,23.45) v1(53.72,24.09) v1(53.72,23.45) v1(53.63,1.42) v1(54.35,1.42) v1(54.44,16.33) v1(54.44,15.62) v1(54.44,14.9) v1(54.44,14.18) v1(54.44,13.46) v1(55.06,1.42) v1(55.15,16.33) v1(55.15,15.62) v1(55.15,14.9) v1(55.15,14.18) v1(55.15,13.46) v1(55.69,5.29) v1(55.69,4.65) v1(55.78,1.42) v1(55.87,16.33) v1(55.87,15.62) v1(55.87,14.9) v1(55.87,14.18) v1(55.87,13.46) v1(56.32,5.29) v1(56.32,4.65) v1(56.39,19.89) v1(56.39,19.26) v1(56.6,16.33) v1(56.6,15.62) v1(56.6,14.9) v1(56.6,14.18) v1(56.6,13.46) v1(57.31,16.33) v1(57.31,15.62) v1(57.31,14.9) v1(57.31,14.18) v1(57.31,13.46) v1(58.03,16.33) v1(58.03,15.62) v1(58.03,14.9) v1(58.03,14.18) v1(58.03,13.46) v1(58.75,15.62) v1(58.75,14.9) v1(58.75,14.18) v1(58.75,13.46) v1(62.34,23.83) v1(62.99,23.83) v1(63.64,23.83) v1(63.64,23.18) v1(65.58,20.72) v1(65.58,20) v1(65.58,19.28) v1(65.58,18.57) v1(66.3,20.72) v1(66.3,20) v1(66.3,19.28) v1(66.3,18.57) v1(73.14,14.85) v1(73.4,18.07) v1(73.4,17.35) v1(73.86,14.85) v1(74.12,18.07) v1(74.12,17.35) v1(74.83,18.07) v1(74.83,17.35) v1(81.71,22.64) v1(81.71,21.93) v1(82.44,22.64) v1(82.44,21.93) v1(86.09,9.12) v1(86.09,8.4) v1(86.37,1.99) v1(86.35,1.17) v1(86.82,9.12) v1(86.82,8.4) v1(87.09,1.99) v1(87.07,1.17) v1(87.07,1.17) v1(87.81,1.99) v1(87.79,1.17) v1(87.79,1.17) v1(88.51,1.17) v1(88.5,1.17) v1(88.53,1.99) v1(89.22,1.17) v1(89.25,1.99) v1(89.23,1.17) v1(89.97,1.99) v1(89.95,1.17) v1(89.95,1.17) v1(90.28,22.33) v1(90.28,21.61) v1(90.68,1.99) v1(90.67,1.17) v1(91.01,22.33) v1(91.01,21.61) v1(91.41,1.99) v1(91.39,1.17) v1(92.13,1.99) v1(92.11,1.17) v1(92.38,9.12) v1(92.38,8.4) v1(93.1,9.12) v1(93.1,8.4) v1(94.41,10.39) v1(94.41,9.67) v1(95.14,10.39) v1(95.14,9.67) v1(97.57,34.84) v1(97.57,34.84) v1(97.57,34.12) v1(97.57,33.4) v1(97.57,32.68) v1(97.53,28.53) v1(97.53,27.81) v1(97.53,27.81) v1(97.53,27.09) v1(97.53,27.09) v1(97.53,26.38) v1(97.53,26.37) v1(97.53,25.66) v1(97.53,25.65) v1(97.53,24.93) v1(97.53,24.93) v1(97.53,24.22) v1(97.53,23.49) v1(97.53,22.77) v1(97.53,17.29) v1(97.53,16.57) v1(97.53,16.57) v1(97.53,15.85) v1(97.53,15.85) v1(97.53,15.13) v1(97.53,15.13) v1(97.53,14.42) v1(97.53,14.41) v1(97.53,13.69) v1(97.53,13.69) v1(97.53,12.97) v1(97.53,12.25) v1(97.53,11.53) v1(98.39,34.82) v1(98.39,34.1) v1(98.39,33.38) v1(98.39,32.66) v1(98.35,28.51) v1(98.35,27.79) v1(98.35,27.07) v1(98.35,26.35) v1(98.35,25.63) v1(98.35,24.92) v1(98.35,24.2) v1(98.35,23.47) v1(98.35,22.75) v1(98.35,17.27) v1(98.35,16.55) v1(98.35,15.83) v1(98.35,15.11) v1(98.35,14.39) v1(98.35,13.67) v1(98.35,12.96) v1(98.35,12.23) v1(98.35,11.51)
PGND: length 60.5
  Top Layer w0.254: v1(87.73,33.23) 90.17,33.23 ; v1(27.8,52.03) 27.17,51.4 R9.2 ; v1(74.79,10.86) 75.17,11.25 75.17,11.7 74.72,12.14
  Inner2 w0.254: v1(74.79,10.86) 74.93,10.86 75.17,10.62 75.17,10.31 ; v1(26.48,41.73) 26.12,41.73 25.26,42.59 25.26,45.29 24.12,46.44 24.12,51.26 24.88,52.03 v1(27.8,52.03) ; 75.17,10.31 75.62,9.86 83.97,9.86 84.7,10.59 84.7,27.83 87.29,30.43 87.29,32.78 v1(87.73,33.23)
  Bottom Layer w0.152: 20.96,44.28 20.96,43.14 21.35,42.75 C14.1
  vias: v1(25.01,38.45) v1(25,37.63) v1(25.04,40.91) v1(25.04,40.09) v1(25.03,39.27) v1(25.71,37.63) v1(25.76,40.91) v1(25.76,40.09) v1(25.75,39.27) v1(25.73,38.45) v1(26.48,40.91) v1(26.48,40.09) v1(26.47,39.27) v1(26.45,38.45) v1(26.43,37.63) v1(27.2,41.73) v1(27.2,40.91) v1(27.2,40.09) v1(27.18,39.27) v1(27.17,38.45) v1(27.15,37.63) v1(27.92,41.73) v1(27.92,40.91) v1(27.92,40.09) v1(27.91,39.27) v1(27.89,38.45) v1(27.87,37.63) v1(28.63,39.27) v1(28.61,38.45) v1(28.59,37.63) v1(28.64,41.73) v1(28.64,40.91) v1(28.64,40.09) v1(29.31,37.63) v1(29.36,41.73) v1(29.36,40.91) v1(29.36,40.09) v1(29.34,39.27) v1(29.33,38.45) v1(30.08,41.73) v1(30.08,40.91) v1(30.08,40.09) v1(30.06,39.27) v1(30.04,38.45) v1(30.03,37.63) v1(32.92,38.45) v1(32.91,37.63) v1(32.95,41.73) v1(32.95,40.91) v1(32.95,40.09) v1(32.94,39.27) v1(33.62,37.63) v1(33.67,41.73) v1(33.67,40.91) v1(33.67,40.09) v1(33.66,39.27) v1(33.64,38.45) v1(34.39,41.73) v1(34.39,40.91) v1(34.39,40.09) v1(34.38,39.27) v1(34.36,38.45) v1(34.34,37.63) v1(35.11,41.73) v1(35.11,40.91) v1(35.11,40.09) v1(35.09,39.27) v1(35.08,38.45) v1(35.06,37.63) v1(35.81,39.27) v1(35.79,38.45) v1(35.78,37.63) v1(35.83,41.73) v1(35.83,40.91) v1(35.83,40.09) v1(36.51,38.45) v1(36.5,37.63) v1(36.55,41.73) v1(36.55,40.91) v1(36.55,40.09) v1(36.53,39.27) v1(37.21,37.63) v1(37.26,41.73) v1(37.26,40.91) v1(37.26,40.09) v1(37.25,39.27) v1(37.23,38.45) v1(37.98,41.73) v1(37.98,40.91) v1(37.98,40.09) v1(37.97,39.27) v1(37.95,38.45) v1(37.94,37.63) v1(38.7,41.73) v1(38.7,40.91) v1(38.7,40.09) v1(38.69,39.27) v1(38.67,38.45) v1(38.66,37.63) v1(43.01,41.73) v1(43.01,40.91) v1(43.01,40.09) v1(43,39.27) v1(42.99,38.45) v1(42.97,37.63) v1(43.72,39.27) v1(43.7,38.45) v1(43.69,37.63) v1(43.73,41.73) v1(43.73,40.91) v1(43.73,40.09) v1(44.42,38.45) v1(44.41,37.63) v1(44.45,41.73) v1(44.45,40.91) v1(44.45,40.09) v1(44.44,39.27) v1(45.12,37.63) v1(45.17,41.73) v1(45.17,40.91) v1(45.17,40.09) v1(45.16,39.27) v1(45.14,38.45) v1(45.89,41.73) v1(45.89,40.91) v1(45.89,40.09) v1(45.87,39.27) v1(45.86,38.45) v1(45.84,37.63) v1(46.61,41.73) v1(46.61,40.91) v1(46.61,40.09) v1(46.59,39.27) v1(46.58,38.45) v1(46.56,37.63) v1(87.88,30.03) v1(87.86,29.21) v1(88.58,30.85) v1(88.6,30.03) v1(88.58,29.21) v1(89.3,30.85) v1(89.31,30.03) v1(89.3,29.21) v1(89.97,48.72) v1(89.97,48) v1(89.97,47.29) v1(89.97,46.57) v1(89.97,45.85) v1(89.97,45.13) v1(89.97,44.41) v1(89.97,43.68) v1(89.97,42.97) v1(89.97,42.25) v1(89.97,41.53) v1(89.97,40.81) v1(89.97,40.09) v1(89.97,39.38) v1(89.97,38.66) v1(90.01,30.85) v1(90.01,29.21) v1(90.03,35.64) v1(90.03,30.03) v1(90.79,48.71) v1(90.79,47.99) v1(90.79,47.26) v1(90.79,46.55) v1(90.79,45.83) v1(90.79,45.11) v1(90.79,44.39) v1(90.79,43.67) v1(90.79,42.95) v1(90.79,42.23) v1(90.79,41.51) v1(90.79,40.8) v1(90.79,40.08) v1(90.79,39.36) v1(90.79,38.64) v1(90.75,35.64) v1(90.73,30.85) v1(90.75,30.03) v1(90.73,29.21) v1(91.47,35.64) v1(91.47,34.95) v1(91.47,34.13) v1(91.47,33.31) v1(91.47,32.49) v1(91.47,31.67) v1(91.45,30.85) v1(91.47,30.03) v1(91.45,29.21) v1(91.61,48.69) v1(91.61,47.97) v1(91.61,47.25) v1(91.61,46.53) v1(91.61,45.81) v1(91.61,45.09) v1(91.61,44.38) v1(91.61,43.65) v1(91.61,42.93) v1(91.61,42.21) v1(91.61,41.5) v1(91.61,40.78) v1(91.61,40.06) v1(91.61,39.34) v1(91.61,38.63) v1(92.19,35.64) v1(92.19,34.95) v1(92.19,34.13) v1(92.19,33.31) v1(92.19,32.49) v1(92.19,31.67) v1(92.19,30.85) v1(92.19,30.03) v1(92.19,29.21) v1(92.43,48.67) v1(92.43,47.95) v1(92.43,47.23) v1(92.43,46.51) v1(92.43,45.79) v1(92.43,45.08) v1(92.43,44.36) v1(92.43,43.63) v1(92.43,42.91) v1(92.43,42.2) v1(92.43,41.48) v1(92.43,40.76) v1(92.43,40.04) v1(92.43,39.33) v1(92.43,38.61) v1(93.25,48.66) v1(93.25,47.94) v1(93.25,47.21) v1(93.25,46.49) v1(93.25,45.78) v1(93.25,45.06) v1(93.25,44.34) v1(93.25,43.62) v1(93.25,42.9) v1(93.25,42.18) v1(93.25,41.46) v1(93.25,40.74) v1(93.25,40.03) v1(93.25,39.31) v1(93.25,38.59) v1(94.07,48.64) v1(94.07,47.92) v1(94.07,47.2) v1(94.07,46.48) v1(94.07,45.76) v1(94.07,45.04) v1(94.07,44.32) v1(94.07,43.6) v1(94.07,42.88) v1(94.07,42.16) v1(94.07,41.45) v1(94.07,40.73) v1(94.07,40.01) v1(94.07,39.29) v1(94.07,38.58) v1(94.89,48.62) v1(94.89,47.9) v1(94.89,47.18) v1(94.89,46.46) v1(94.89,45.74) v1(94.89,45.03) v1(94.89,44.31) v1(94.89,43.58) v1(94.89,42.86) v1(94.89,42.15) v1(94.89,41.43) v1(94.89,40.71) v1(94.89,39.99) v1(94.89,39.28) v1(94.89,38.56) v1(95.7,48.6) v1(95.7,47.89) v1(95.7,47.16) v1(95.7,46.44) v1(95.7,45.73) v1(95.7,45.01) v1(95.7,44.29) v1(95.7,43.57) v1(95.7,42.85) v1(95.7,42.13) v1(95.7,41.41) v1(95.7,40.69) v1(95.7,39.98) v1(95.7,39.26) v1(95.7,38.54) v1(96.53,48.59) v1(96.53,47.87) v1(96.53,47.14) v1(96.53,46.43) v1(96.53,45.71) v1(96.53,44.99) v1(96.53,44.27) v1(96.53,43.55) v1(96.53,42.83) v1(96.53,42.11) v1(96.53,41.4) v1(96.53,40.68) v1(96.53,39.96) v1(96.53,39.24) v1(96.53,38.52) v1(97.34,48.57) v1(97.34,47.85) v1(97.34,47.13) v1(97.34,46.41) v1(97.34,45.69) v1(97.34,44.97) v1(97.34,44.26) v1(97.34,43.53) v1(97.34,42.81) v1(97.34,42.1) v1(97.34,41.38) v1(97.34,40.66) v1(97.34,39.94) v1(97.34,39.23) v1(97.34,38.51) v1(98.16,48.55) v1(98.16,47.84) v1(98.16,47.11) v1(98.16,46.39) v1(98.16,45.68) v1(98.16,44.96) v1(98.16,44.24) v1(98.16,43.52) v1(98.16,42.8) v1(98.16,42.08) v1(98.16,41.36) v1(98.16,40.64) v1(98.16,39.93) v1(98.16,39.21) v1(98.16,38.49) v1(98.98,48.54) v1(98.98,47.82) v1(98.98,47.09) v1(98.98,46.38) v1(98.98,45.66) v1(98.98,44.94) v1(98.98,44.22) v1(98.98,43.5) v1(98.98,42.78) v1(98.98,42.06) v1(98.98,41.34) v1(98.98,40.63) v1(98.98,39.91) v1(98.98,39.19) v1(98.98,38.47)
PGND_IN: length 13.6
  Top Layer w0.254: 14.49,50.5 v1(14.49,51.55)
  Inner2 w0.254: v1(14.49,51.55) 14.49,50.47 14.85,50.12 15.48,50.12 15.99,49.61 15.99,42.06 15.71,41.78 CN3.2
  vias: v1(0.74,43.49) v1(0.74,42.67) v1(0.74,41.85) v1(0.74,41.03) v1(0.74,40.21) v1(1.46,43.49) v1(1.46,42.67) v1(1.46,41.85) v1(1.46,41.03) v1(1.46,40.21) v1(2.18,43.49) v1(2.18,42.67) v1(2.18,41.85) v1(2.18,41.03) v1(2.18,40.21) v1(2.9,43.49) v1(2.9,42.67) v1(2.9,41.85) v1(2.9,41.03) v1(2.9,40.21) v1(3.62,43.49) v1(3.62,42.67) v1(3.62,41.85) v1(3.62,41.03) v1(3.62,40.21) v1(4.34,43.49) v1(4.34,42.67) v1(4.34,41.85) v1(4.34,41.03) v1(4.34,40.21) v1(5.05,43.49) v1(5.05,42.67) v1(5.05,41.85) v1(5.05,41.03) v1(5.05,40.21) v1(5.77,43.49) v1(5.77,42.67) v1(5.77,41.85) v1(5.77,41.03) v1(5.77,40.21) v1(6.49,43.49) v1(6.49,42.67) v1(6.49,41.85) v1(6.49,41.03) v1(6.49,40.21) v1(7.21,43.49) v1(7.21,42.67) v1(7.21,41.85) v1(7.21,41.03) v1(7.21,40.21) v1(7.93,43.49) v1(7.93,42.67) v1(7.93,41.85) v1(7.93,41.03) v1(7.93,40.21) v1(8.65,43.49) v1(8.65,42.67) v1(8.65,41.85) v1(8.65,41.03) v1(8.65,40.21) v1(9.37,43.49) v1(9.37,42.67) v1(9.37,41.85) v1(9.37,41.03) v1(9.37,40.21) v1(10.09,43.49) v1(10.09,42.67) v1(10.09,41.85) v1(10.09,41.03) v1(10.09,40.21) v1(10.81,43.49) v1(10.81,42.67) v1(10.81,41.85) v1(10.81,41.03) v1(10.81,40.21) v1(11.52,43.49) v1(11.52,42.67) v1(11.52,41.85) v1(11.52,41.03) v1(11.52,40.21) v1(12.24,43.49) v1(12.24,42.67) v1(12.24,41.85) v1(12.24,41.03) v1(12.24,40.21) v1(16.89,42.88) v1(16.89,42.06) v1(16.89,41.25) v1(16.89,40.44) v1(16.89,39.62) v1(16.89,38.81) v1(17.74,42.88) v1(17.74,42.06) v1(17.74,41.25) v1(17.74,40.44) v1(17.74,39.62) v1(17.74,38.81) v1(18.59,42.88) v1(18.59,42.06) v1(18.59,41.25) v1(18.59,40.44) v1(18.59,39.62) v1(18.59,38.81) v1(19.44,42.88) v1(19.44,42.06) v1(19.44,41.25) v1(19.44,40.44) v1(19.44,39.62) v1(19.44,38.81) v1(20.29,42.88) v1(20.29,42.06) v1(20.29,41.25) v1(20.29,40.44) v1(20.29,39.62) v1(20.29,38.81)
VBUS: length 33.3
  Top Layer w0.127: 67.67,29.29 67.67,28.19 67.96,27.9 ; 67.96,27.9 67.66,27.6 67.66,25.24 67.66,25.24 67.68,25.22 v1(67.68,23.96) ; 67.96,27.9 CN40.1 ; U1.23 v1(55.88,8.94)
  Inner2 w0.127: v1(66.28,13.42) 65.96,13.1 65.96,10.75 64.69,9.48 56.42,9.48 v1(55.88,8.94)
  内层4 w0.127: v1(66.28,13.42) 66.54,13.42 67.68,14.56 v1(67.68,23.96)
VCC: length 342.5
  Top Layer w0.203: U1.32 60.38,9.62 C56.2 62.93,9.04 v1(63.17,9.04)
  Top Layer w0.254: IPSLCD1.12 24.96,21.2 v1(24.63,20.87) 24.63,20.15 24.97,19.81 IPSLCD1.10 ; D17.1 v1(81.65,27.91) ; U3.5 4.92,34.69 4.62,35 4.62,32.09 v1(4.69,32.02) ; 38.16,2.76 R32.2 v1(37.21,2.76) ; D15.1 v1(71.62,27.91) ; v1(66.66,27.91) D18.1 65.8,27.91 65.3,28.41 65.3,29.4 R103.1 ; v1(54.6,27.9) 55.74,29.04 58.76,29.04 59.11,29.39 R104.1 ; C55.2 v1(50.13,21.05) ; C55.2 52.88,21.05 U1.64 ; C55.2 50.91,19.87 U1.1 ; v1(6.21,2.75) 7.16,2.75 R29.2 ; v1(7.1,24.34) 7.1,23.09 7.08,23.07 ; R33.2 48.49,2.75 v1(47.55,2.75) ; v1(50.13,11.11) C32.2 50.91,12.3 U1.16 ; 62.38,21.02 v1(61.6,21.02) ; 62.38,21.02 U1.48 ; 62.38,21.02 C31.2 ; v1(4.69,32.02) 4.69,31.08 CN9.1 ; v1(4.69,32.02) 4.72,32.05 C33.2 ; D16.1 v1(76.57,27.91) ; 17.52,2.76 R30.2 v1(16.57,2.76) ; CN34.1 v1(94.85,32.35) ; U9.5 v1(9.98,17.91) ; R31.2 27.79,2.75 v1(26.85,2.75) ; CN5.1 v1(34.71,53.5) ; CN47.1 96.13,21.85
  Inner2 w0.152: v1(34.71,53.5) 33.87,52.66 32.63,52.66 31.04,51.07 31.04,36.72 30.21,35.9 14.02,35.9 13.32,36.59 5.64,36.59 4.69,35.64 v1(4.69,32.02)
  Inner2 w0.254: v1(7.1,24.34) 7.1,19.01 8.2,17.91 v1(9.98,17.91) ; v1(61.6,21.02) 61.56,21.05 v1(50.13,21.05) ; v1(13.83,4.78) 13.83,3.38 14.34,2.88 16.75,2.88
  内层3 w0.254: v1(7.1,24.34) 5.13,24.34 4.69,24.78 v1(4.69,32.02) ; v1(6.21,2.75) 16.56,2.75 v1(16.57,2.76) 26.84,2.76 v1(26.85,2.75) 37.15,2.75 ; v1(66.66,27.91) v1(71.62,27.91) v1(76.57,27.91) v1(81.65,27.91) 96.13,27.91 ; v1(66.66,27.91) 66.66,26.5 65.9,25.74 62.34,25.74 61.6,24.99 v1(61.6,21.02) 61.62,21.04 64,21.04 64.88,20.15 64.88,11.89 63.17,10.18 v1(63.17,9.04) ; v1(66.66,27.91) 66.65,27.9 64.12,27.9 63.74,27.51 54.98,27.51 v1(54.6,27.9) ; v1(13.83,4.78) 13.83,5.54 14.47,6.18 14.47,17.91 ; 14.47,17.91 23.65,17.91 24.63,18.88 v1(24.63,20.87) 24.63,22.05 25.26,22.69 44.56,22.69 46.2,21.05 v1(50.13,21.05) v1(50.13,11.11) ; 14.47,17.91 v1(9.98,17.91) ; 96.13,27.91 96.13,32.05 95.83,32.35 v1(94.85,32.35) ; 96.13,27.91 v1(96.13,21.84) 96.13,6.69 94.6,5.16 R35.1 ; v1(47.55,2.75) 47.54,2.76 v1(37.21,2.76)
(no net): length 0.6
  Top Layer w0.254: USBC1.A4 USBC1.B9 ; USBC1.A9 USBC1.B4
ADSPE: length 51
  Top Layer w0.127: U1.22 v1(55.38,8.52)
  Top Layer w0.152: v1(98.73,6.18) 98.73,7.37 CN10.1 97.96,8.14 C53.2 ; R37.1 97.01,8.14
  Inner2 w0.127: v1(55.38,8.52) 55.38,7.9 55.83,7.45 87.3,7.45 88.25,6.5 98.41,6.5 v1(98.73,6.18)
APH4: length 28.3
  Top Layer w0.127: U1.11 v1(52.69,14.83)
  Inner2 w0.127: v1(52.69,14.83) 51.95,14.83 51.74,14.62 51.74,10.81 52.31,10.24 52.31,7.83 52.95,7.19 65.39,7.19 65.71,6.88 v1(65.71,6.12)
  内层4 w0.127: 67.36,8.72 66.34,8.72 65.71,8.08 v1(65.71,6.12)
BDM: length 57
  Top Layer w0.127: 12.3,9.1 12.8,9.61 13.32,9.61 v1(13.58,9.35) ; U1.45 v1(60.98,18.33)
  内层4 w0.127: v1(13.58,9.35) 13.83,9.61 31.48,9.61 33.39,11.51 33.39,16.47 33.83,16.91 58.34,16.91 59.77,18.33 v1(60.98,18.33)
BDP: length 57.1
  Top Layer w0.127: v1(13.58,10.12) 13.32,9.86 12.8,9.86 12.3,10.37 ; U1.46 v1(60.57,18.83)
  内层4 w0.127: v1(13.58,10.12) 13.83,9.86 31.38,9.86 33.13,11.62 33.13,16.57 33.73,17.16 58.22,17.16 59.89,18.83 v1(60.57,18.83)
CAN_H: length 14
  Top Layer w0.127: U9.7 11.9,17.72 11.71,17.54 11.71,17.24 12.3,16.66 12.3,16.59 11.67,15.97 11.67,14.94 11.16,14.43 9.39,14.43 8.88,14.94 8.88,17.86 7.61,19.13 6.34,19.13 5.84,18.63 CN11.2
CAN_L: length 13.6
  Top Layer w0.127: U9.6 11.25,17.73 11.43,17.55 11.43,17.23 10.79,16.59 11.42,15.97 11.42,15.05 11.06,14.69 9.49,14.69 9.13,15.05 9.13,17.97 7.71,19.39 6.33,19.39 5.83,19.88 CN11.1
CAN_RX: length 48.7
  Top Layer w0.127: U1.61 v1(54.38,20.02) ; U9.4 10.59,20.78 10.02,20.78
  内层4 w0.127: v1(54.38,20.02) 54.11,19.76 53.83,19.76 52.87,18.79 11.91,18.79 11.42,19.28 11.42,20.28 10.92,20.77 v1(10.02,20.77)
CAN_TX: length 47.8
  Top Layer w0.127: U1.62 v1(53.88,20.44) ; U9.1 v1(13.2,20.77)
  内层4 w0.127: v1(53.88,20.44) 53.66,20.21 53.66,19.94 52.76,19.04 12.02,19.04 11.67,19.39 11.67,20.28 12.17,20.77 v1(13.2,20.77)
CLK: length 65.7
  Top Layer w0.127: v1(6.85,28.87) 6.59,29.13 6.21,29.13 5.67,28.58 CN9.3 ; U1.50 v1(59.88,23.23)
  内层4 w0.127: v1(6.85,28.87) 7.1,29.13 8.68,29.13 9.64,28.17 9.64,24.74 10.3,24.09 12.84,24.09 14.08,22.84 14.08,21.06 15.73,19.41 51.68,19.41 53.74,21.47 56.81,21.47 59.12,23.78 59.63,23.78 59.88,23.52 v1(59.88,23.23)
CSN: length 33
  Top Layer w0.127: 57.38,21.78 v1(57.38,23.18) ; R121.2 v1(85.46,23.07)
  内层4 w0.127: v1(85.46,23.07) 85.46,23.58 83.93,25.1 58.15,25.1 57.38,24.33 v1(57.38,23.18)
DAC: length 14.1
  Top Layer w0.127: CN12.1 59.92,1.12 R47.1 58.91,2.51 57.4,4.01 54.99,4.01 53.38,5.62 U1.18
DCBUS: length 33.4
  Top Layer w0.127: v1(69.08,33.23) 69.08,32.72 68.31,31.96 66.41,31.96 66.16,31.71 R87.1
  Top Layer w0.254: R2.2 v1(18.66,53.8)
  Top Layer w0.635: 34.75,28.59 35.48,28.59 36.82,29.93
  Top Layer w0.762: 36.82,29.93 38.79,29.93
  内层4 w0.127: v1(69.08,33.23) 54.06,33.23 v1(53.07,34.23)
  内层4 w0.254: v1(18.66,53.8) 20.69,53.8 21.5,53 v1(21.5,49.61)
  vias: v1(19.8,49.61) v1(19.8,48.8) v1(19.8,47.99) v1(19.8,47.17) v1(19.8,46.36) v1(19.8,45.55) v1(20.65,49.61) v1(20.65,48.8) v1(20.65,47.99) v1(20.65,47.17) v1(20.65,46.36) v1(20.65,45.55) v1(21.5,48.8) v1(21.5,47.99) v1(21.5,47.17) v1(21.5,46.36) v1(21.5,45.55) v1(22.34,49.61) v1(22.34,48.8) v1(22.34,47.99) v1(22.34,47.17) v1(22.34,46.36) v1(22.34,45.55) v1(23.19,49.61) v1(23.19,48.8) v1(23.19,47.99) v1(23.19,47.17) v1(23.19,46.36) v1(23.19,45.55) v1(25.02,48.2) v1(25.03,49.83) v1(25.03,49.02) v1(25.75,49.83) v1(25.75,49.02) v1(25.74,48.2) v1(26.47,49.83) v1(26.47,49.02) v1(26.45,48.2) v1(26.46,47.12) v1(27.19,49.83) v1(27.19,49.02) v1(27.17,48.2) v1(27.18,47.12) v1(27.91,49.83) v1(27.91,49.02) v1(27.9,48.2) v1(27.9,47.12) v1(28.61,48.2) v1(28.61,47.12) v1(28.63,50.66) v1(28.63,49.83) v1(28.63,49.02) v1(29.35,50.66) v1(29.35,49.83) v1(29.35,49.02) v1(29.33,48.2) v1(29.33,47.12) v1(30.06,50.66) v1(30.06,49.83) v1(30.06,49.02) v1(30.05,48.2) v1(30.05,47.12) v1(32.94,50.66) v1(32.94,49.83) v1(32.94,49.02) v1(32.93,48.2) v1(32.93,47.12) v1(33.66,50.66) v1(33.66,49.83) v1(33.66,49.02) v1(33.65,48.2) v1(33.65,47.12) v1(34.38,50.66) v1(34.38,49.83) v1(34.38,49.02) v1(34.36,48.2) v1(34.36,47.12) v1(35.1,50.66) v1(35.1,49.83) v1(35.1,49.02) v1(35.08,48.2) v1(35.08,47.12) v1(35.82,50.66) v1(35.82,49.83) v1(35.82,49.02) v1(35.8,48.2) v1(35.8,47.12) v1(36.52,48.2) v1(36.52,47.12) v1(36.53,50.66) v1(36.53,49.83) v1(36.53,49.02) v1(37.25,50.66) v1(37.25,49.83) v1(37.25,49.02) v1(37.23,48.2) v1(37.23,47.12) v1(37.45,29.17) v1(37.45,28.53) v1(37.97,50.66) v1(37.97,49.83) v1(37.97,49.02) v1(37.96,48.2) v1(37.96,47.12) v1(38.09,29.17) v1(38.09,28.53) v1(38.69,50.66) v1(38.69,49.83) v1(38.69,49.02) v1(38.68,48.2) v1(38.68,47.12) v1(38.72,29.17) v1(38.72,28.53) v1(39.41,50.66) v1(39.41,49.83) v1(39.41,49.02) v1(39.4,48.2) v1(39.4,47.12) v1(39.36,29.17) v1(39.36,28.53) v1(39.99,30.44) v1(39.99,29.8) v1(39.99,29.17) v1(39.99,28.53) v1(40.11,48.2) v1(40.11,47.12) v1(40.13,50.66) v1(40.13,49.83) v1(40.13,49.02) v1(40.63,30.44) v1(40.63,29.8) v1(40.63,29.17) v1(40.63,28.53) v1(40.85,50.66) v1(40.85,49.83) v1(40.85,49.02) v1(40.83,48.2) v1(40.83,47.12) v1(43.72,50.66) v1(43.72,49.83) v1(43.72,49.02) v1(43.71,48.2) v1(43.71,47.12) v1(44.44,50.66) v1(44.44,49.83) v1(44.44,49.02) v1(44.43,48.2) v1(44.43,47.12) v1(45.16,50.66) v1(45.16,49.83) v1(45.16,49.02) v1(45.15,48.2) v1(45.15,47.12) v1(45.88,50.66) v1(45.88,49.83) v1(45.88,49.02) v1(45.86,48.2) v1(45.86,47.12) v1(46.6,50.66) v1(46.6,49.83) v1(46.6,49.02) v1(46.58,48.2) v1(46.58,47.12) v1(47.32,50.66) v1(47.32,49.83) v1(47.32,49.02) v1(47.3,48.2) v1(47.3,47.12) v1(48.02,48.2) v1(48.02,47.12) v1(48.02,41.21) v1(48.02,34.23) v1(48.04,53.11) v1(48.04,52.29) v1(48.04,51.47) v1(48.04,50.66) v1(48.04,49.83) v1(48.04,49.02) v1(48.04,46.13) v1(48.04,45.31) v1(48.04,44.49) v1(48.04,43.67) v1(48.04,42.85) v1(48.04,42.03) v1(48.04,39.14) v1(48.04,38.32) v1(48.04,37.5) v1(48.04,36.69) v1(48.04,35.86) v1(48.04,35.05) v1(48.75,53.11) v1(48.75,52.29) v1(48.75,51.47) v1(48.75,50.66) v1(48.75,49.83) v1(48.75,49.02) v1(48.74,48.2) v1(48.74,47.12) v1(48.75,46.13) v1(48.75,45.31) v1(48.75,44.49) v1(48.75,43.67) v1(48.75,42.85) v1(48.75,42.03) v1(48.74,41.21) v1(48.75,39.14) v1(48.75,38.32) v1(48.75,37.5) v1(48.75,36.69) v1(48.75,35.86) v1(48.75,35.05) v1(48.74,34.23) v1(49.47,53.11) v1(49.47,52.29) v1(49.47,51.47) v1(49.47,50.66) v1(49.47,49.83) v1(49.47,49.02) v1(49.46,48.2) v1(49.46,47.12) v1(49.47,46.13) v1(49.47,45.31) v1(49.47,44.49) v1(49.47,43.67) v1(49.47,42.85) v1(49.47,42.03) v1(49.46,41.21) v1(49.47,39.14) v1(49.47,38.32) v1(49.47,37.5) v1(49.47,36.69) v1(49.47,35.86) v1(49.47,35.05) v1(49.46,34.23) v1(50.19,53.11) v1(50.19,52.29) v1(50.19,51.47) v1(50.19,50.66) v1(50.19,49.83) v1(50.19,49.02) v1(50.18,48.2) v1(50.18,47.12) v1(50.19,46.13) v1(50.19,45.31) v1(50.19,44.49) v1(50.19,43.67) v1(50.19,42.85) v1(50.19,42.03) v1(50.18,41.21) v1(50.19,39.14) v1(50.19,38.32) v1(50.19,37.5) v1(50.19,36.69) v1(50.19,35.86) v1(50.19,35.05) v1(50.18,34.23) v1(50.91,53.11) v1(50.91,52.29) v1(50.91,51.47) v1(50.91,50.66) v1(50.91,49.83) v1(50.91,49.02) v1(50.89,48.2) v1(50.89,47.12) v1(50.91,46.13) v1(50.91,45.31) v1(50.91,44.49) v1(50.91,43.67) v1(50.91,42.85) v1(50.91,42.03) v1(50.89,41.21) v1(50.91,39.14) v1(50.91,38.32) v1(50.91,37.5) v1(50.91,36.69) v1(50.91,35.86) v1(50.91,35.05) v1(50.89,34.23) v1(51.61,48.2) v1(51.61,47.12) v1(51.61,41.21) v1(51.61,34.23) v1(51.63,53.11) v1(51.63,52.29) v1(51.63,51.47) v1(51.63,50.66) v1(51.63,49.83) v1(51.63,49.02) v1(51.63,46.13) v1(51.63,45.31) v1(51.63,44.49) v1(51.63,43.67) v1(51.63,42.85) v1(51.63,42.03) v1(51.63,39.14) v1(51.63,38.32) v1(51.63,37.5) v1(51.63,36.69) v1(51.63,35.86) v1(51.63,35.05) v1(52.35,53.11) v1(52.35,52.29) v1(52.35,51.47) v1(52.35,50.66) v1(52.35,49.83) v1(52.35,49.02) v1(52.33,48.2) v1(52.33,47.12) v1(52.35,46.13) v1(52.35,45.31) v1(52.35,44.49) v1(52.35,43.67) v1(52.35,42.85) v1(52.35,42.03) v1(52.33,41.21) v1(52.35,39.14) v1(52.35,38.32) v1(52.35,37.5) v1(52.35,36.69) v1(52.35,35.86) v1(52.35,35.05) v1(52.33,34.23) v1(53.07,53.11) v1(53.07,52.29) v1(53.07,51.47) v1(53.07,50.66) v1(53.07,49.83) v1(53.07,49.02) v1(53.07,48.2) v1(53.07,47.12) v1(53.07,46.13) v1(53.07,45.31) v1(53.07,44.49) v1(53.07,43.67) v1(53.07,42.85) v1(53.07,42.03) v1(53.07,41.21) v1(53.07,39.14) v1(53.07,38.32) v1(53.07,37.5) v1(53.07,36.69) v1(53.07,35.86) v1(53.07,35.05)
